# EAGLE design RF-PWR-001 (EAGLE 9.6.2)
DOCNUM: RF-PWR-001; DWBY: Lewis Russell; DWDATE: 3/2/2021; DWINIT: LR; REV: 001; TITLE: RF Power Supply Board

## Sheet 1 of 4
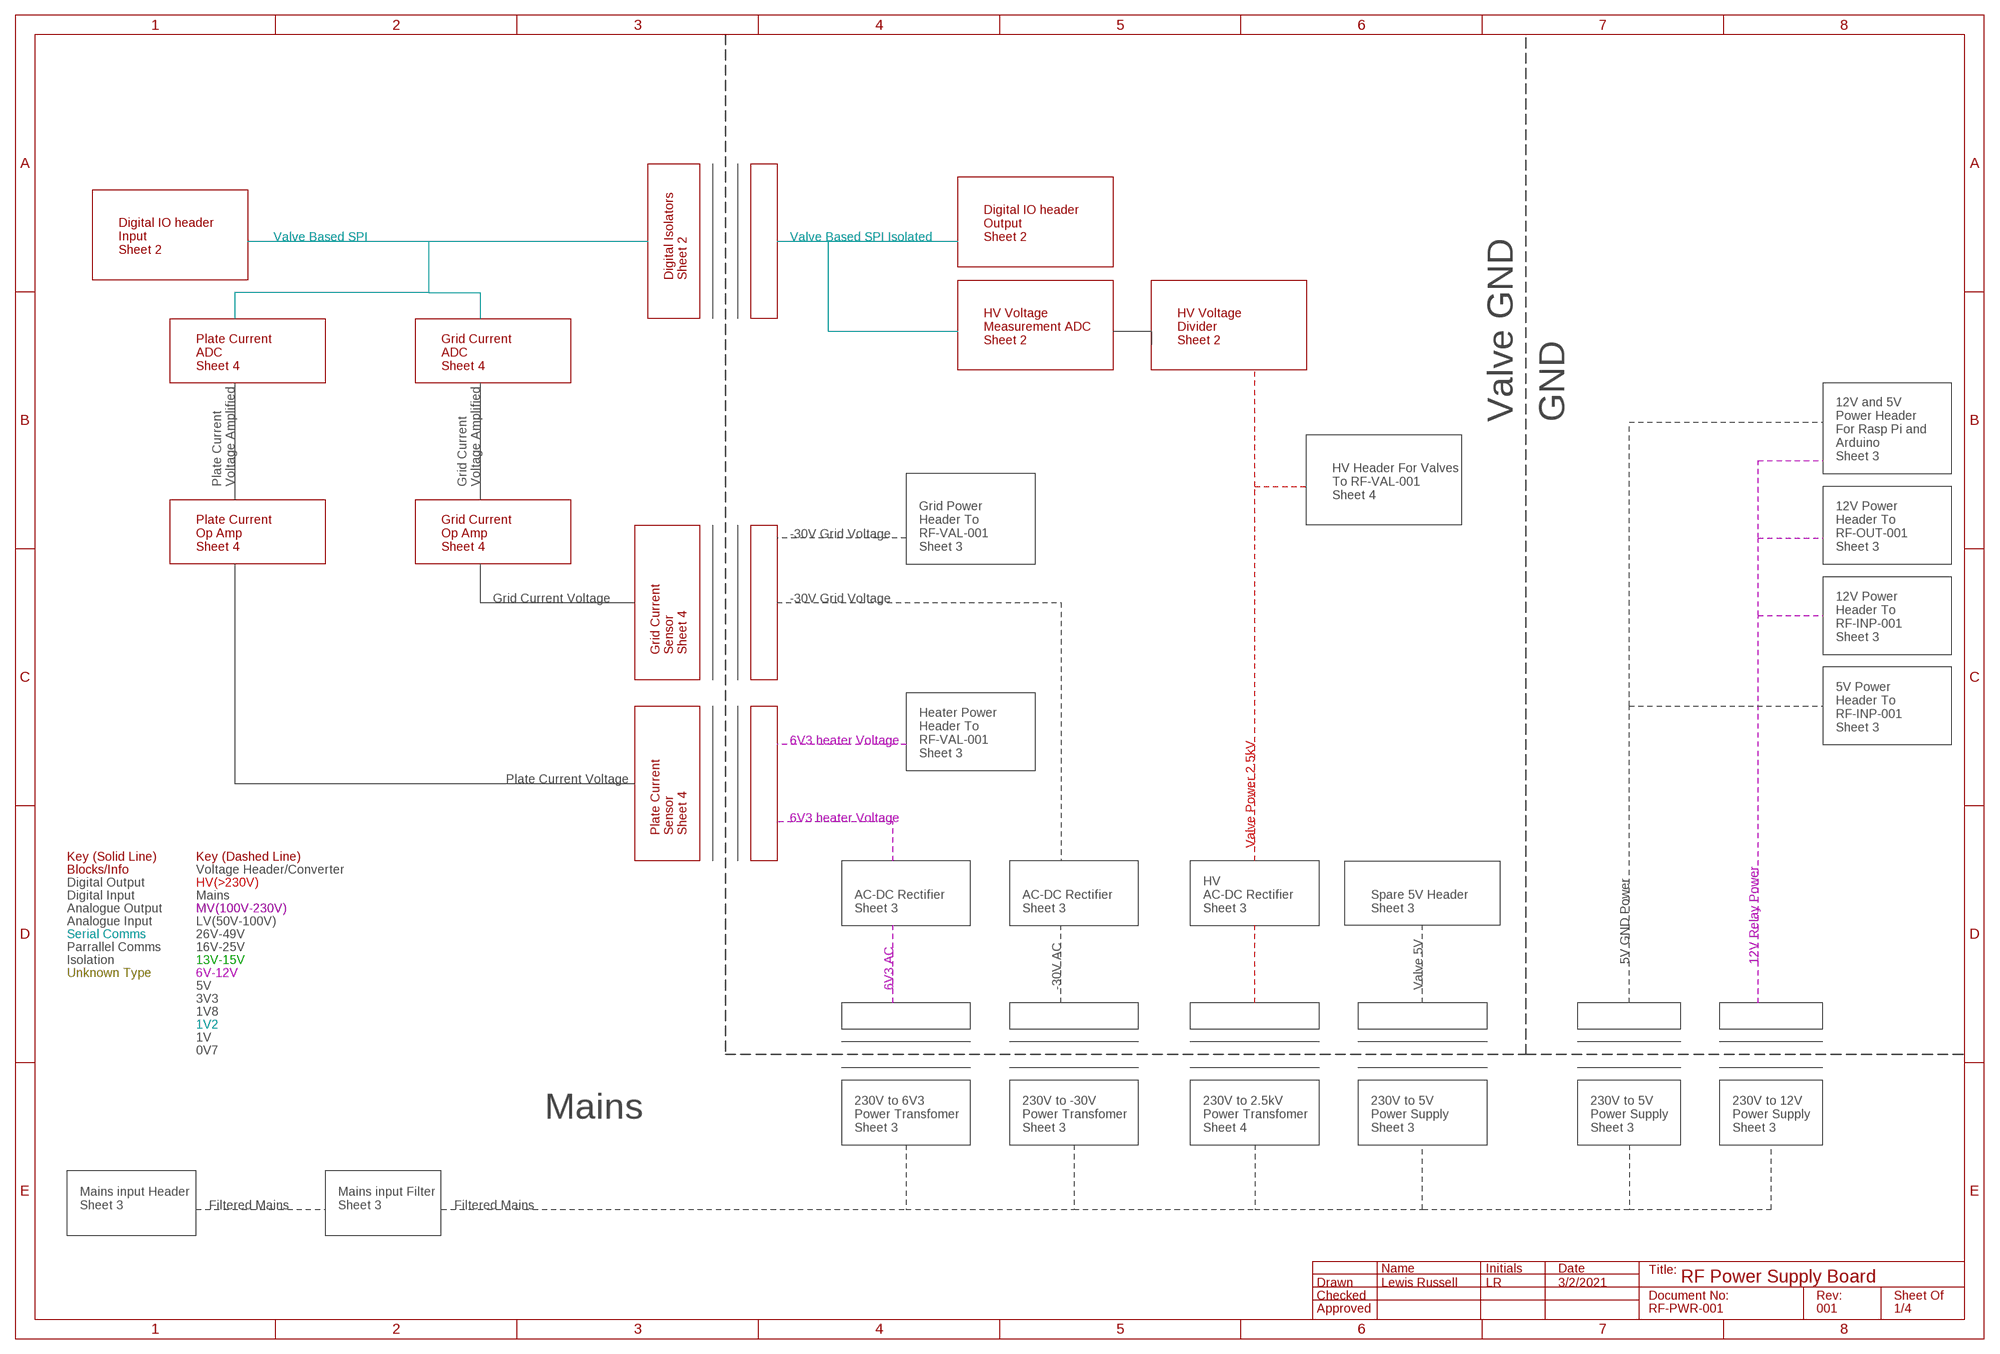
[diagram p0: schematic, sheet 1]

### Notes on the sheet
- Valve Based SPI | Valve Based SPI Isolated
- Digital IO header
  Output
  Sheet 2
- Digital IO header
  Input
  Sheet 2
- Digital Isolators
  Sheet 2
- HV Voltage
  Measurement ADC
  Sheet 2
- HV Voltage
  Divider
  Sheet 2
- Plate Current
  ADC
  Sheet 4
- Grid Current
  ADC
  Sheet 4
- Valve GND | GND
- 12V and 5V
  Power Header 
  For Rasp Pi and
  Arduino
  Sheet 3
- Plate Current
  Voltage Amplified
- Grid Current
  Voltage Amplified
- HV Header For Valves
  To RF-VAL-001
  Sheet 4
- -30V Grid Voltage
- Plate Current
  Op Amp
  Sheet 4
- Grid Current
  Op Amp
  Sheet 4
- Grid Power
  Header To
  RF-VAL-001
  Sheet 3
- 12V Power
  Header To
  RF-OUT-001
  Sheet 3
- Grid Current Voltage | -30V Grid Voltage
- 12V Power
  Header To
  RF-INP-001
  Sheet 3
- Grid Current
  Sensor
  Sheet 4
- 5V Power
  Header To
  RF-INP-001
  Sheet 3
- 6V3 heater Voltage
- Heater Power
  Header To
  RF-VAL-001
  Sheet 3
- Plate Current Voltage
- 6V3 heater Voltage
- Plate Current
  Sensor
  Sheet 4
- Valve Power 2.5kV
- Key (Solid Line) | Key (Dashed Line)
- Blocks/Info | Voltage Header/Converter
- Digital Output | HV(>230V)
- Digital Input | Mains
- Analogue Output | MV(100V-230V)
- AC-DC Rectifier
  Sheet 3
- AC-DC Rectifier
  Sheet 3
- HV
  AC-DC Rectifier
  Sheet 3
- Spare 5V Header 
  Sheet 3
- Analogue Input | LV(50V-100V)
- Serial Comms | 26V-49V
- Parrallel Comms | 16V-25V
- Isolation | 13V-15V | 5V GND Power | 12V Relay Power
- Unknown Type | 6V-12V
- 5V | 6V3 AC | -30V AC | Valve 5V
- 3V3
- 1V8
- 1V2
- 1V
- 0V7
- Mains
- 230V to 6V3
  Power Transfomer
  Sheet 3
- 230V to -30V
  Power Transfomer
  Sheet 3
- 230V to 2.5kV
  Power Transfomer
  Sheet 4
- 230V to 5V
  Power Supply
  Sheet 3
- 230V to 5V
  Power Supply
  Sheet 3
- 230V to 12V
  Power Supply
  Sheet 3
- Mains input Header
  Sheet 3
- Filtered Mains
- Mains input Filter
  Sheet 3
- Filtered Mains

## Sheet 2 of 4: Isolators
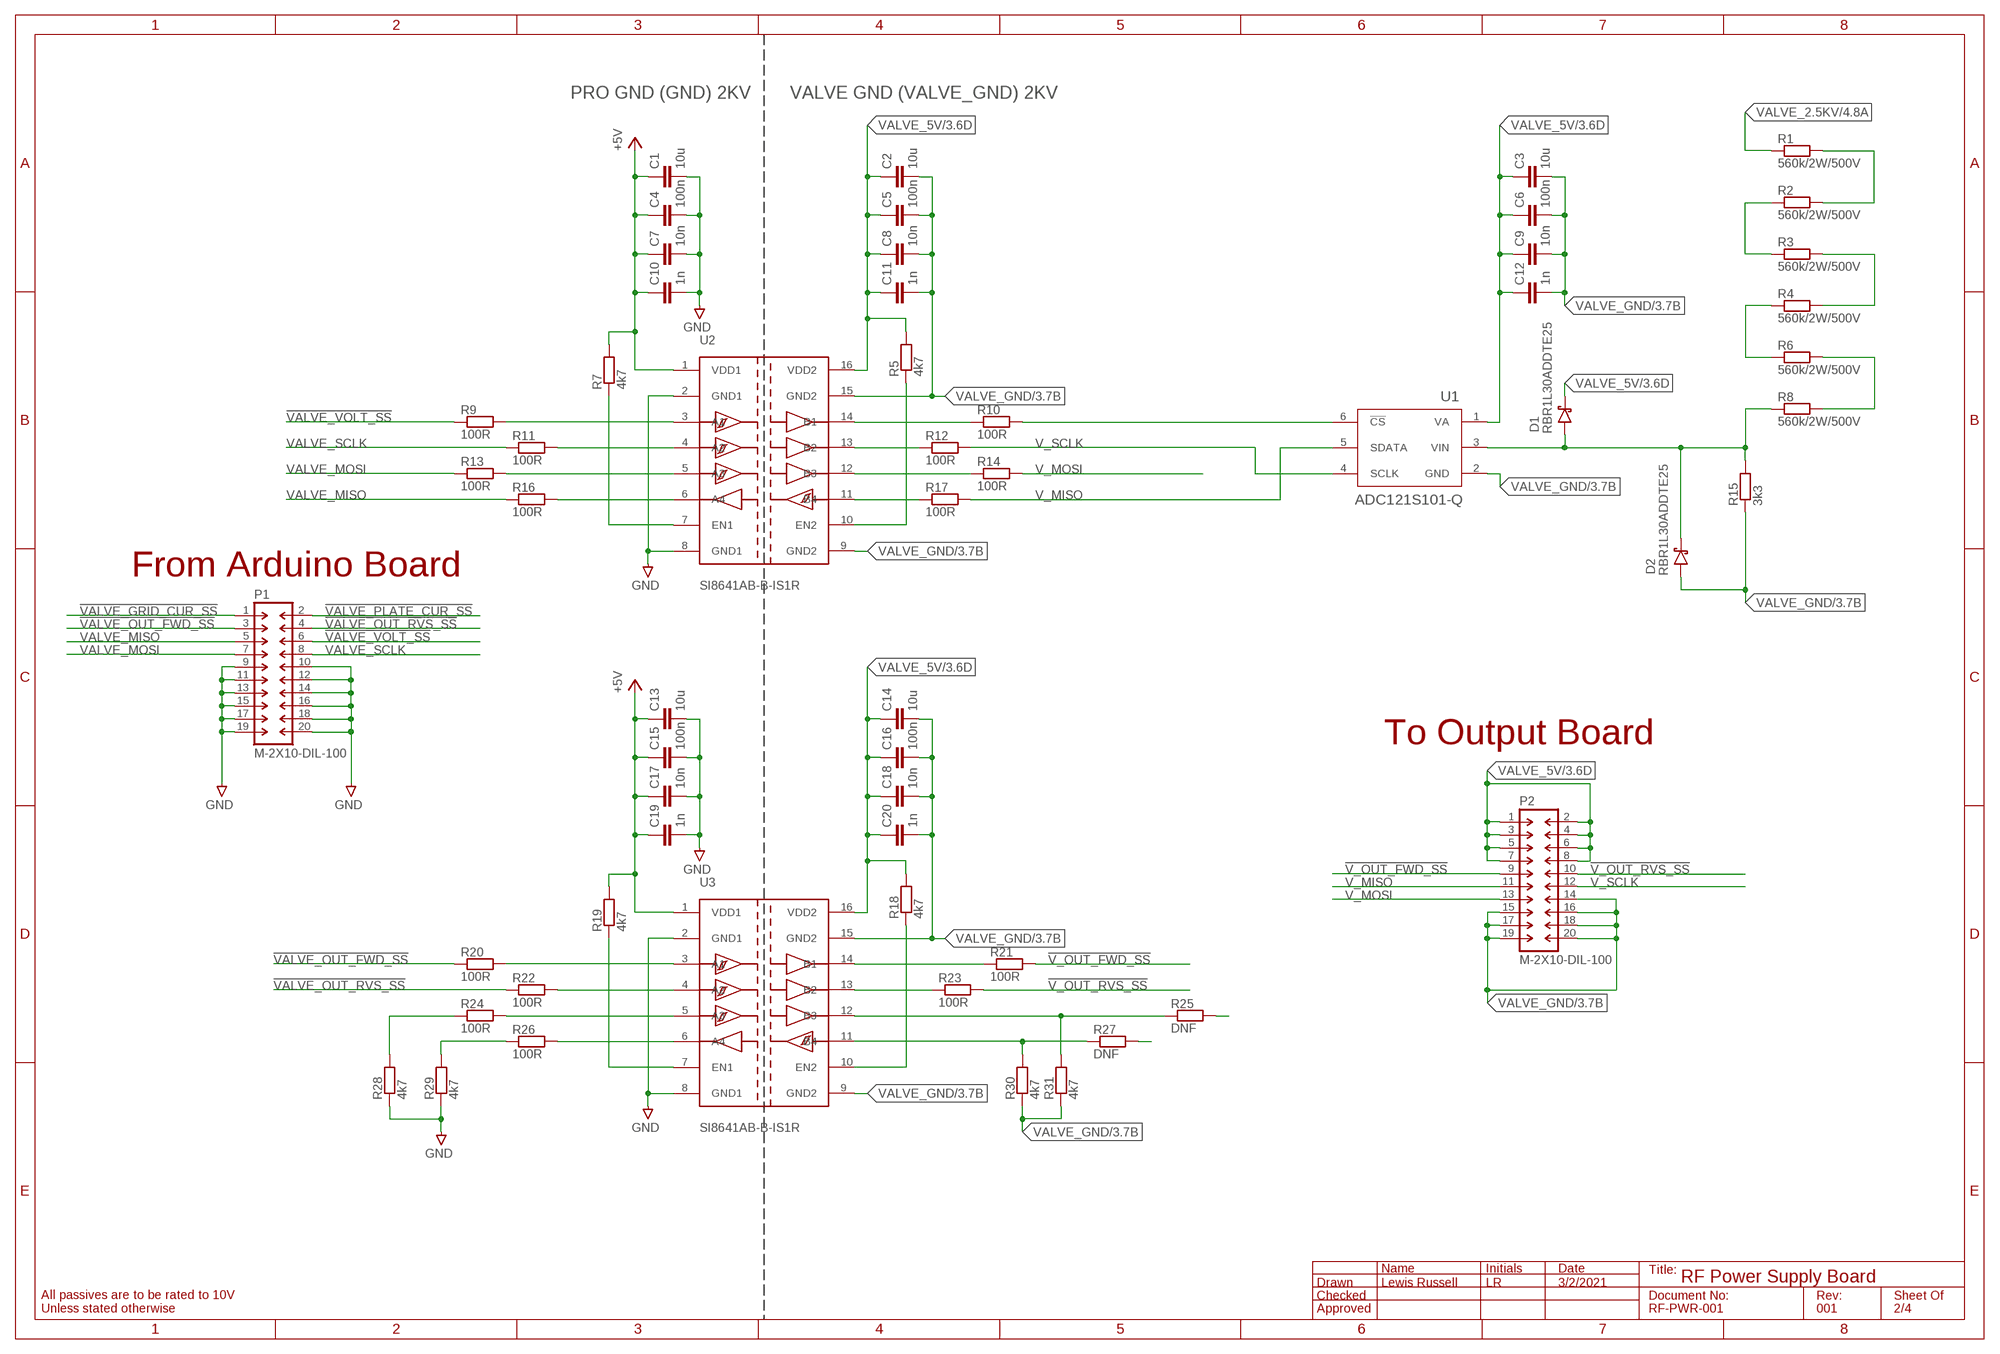
[diagram p1: schematic, sheet 2]

### Parts
C1  10u  C-EUC0805  [C0805]
C2  10u  C-EUC0805  [C0805]
C3  10u  C-EUC0805  [C0805]
C4  100n  C-EUC0603  [C0603]
C5  100n  C-EUC0603  [C0603]
C6  100n  C-EUC0603  [C0603]
C7  10n  C-EUC0603  [C0603]
C8  10n  C-EUC0603  [C0603]
C9  10n  C-EUC0603  [C0603]
C10  1n  C-EUC0603  [C0603]
C11  1n  C-EUC0603  [C0603]
C12  1n  C-EUC0603  [C0603]
C13  10u  C-EUC0805  [C0805]
C14  10u  C-EUC0805  [C0805]
C15  100n  C-EUC0603  [C0603]
C16  100n  C-EUC0603  [C0603]
C17  10n  C-EUC0603  [C0603]
C18  10n  C-EUC0603  [C0603]
C19  1n  C-EUC0603  [C0603]
C20  1n  C-EUC0603  [C0603]
D1  RBR1L30ADDTE25  SCHOTTKY_DIODESMA  [SMA/DO-214AC]
D2  RBR1L30ADDTE25  SCHOTTKY_DIODESMA  [SMA/DO-214AC]
P1  M-2X10-DIL-100  [DIL-100-2X10]
P2  M-2X10-DIL-100  [DIL-100-2X10]
R1  560k/2W/500V  R-EU_SMF2  [SMV1/SMF2]
R2  560k/2W/500V  R-EU_SMF2  [SMV1/SMF2]
R3  560k/2W/500V  R-EU_SMF2  [SMV1/SMF2]
R4  560k/2W/500V  R-EU_SMF2  [SMV1/SMF2]
R5  4k7  R-EUR0603  [R0603]
R6  560k/2W/500V  R-EU_SMF2  [SMV1/SMF2]
R7  4k7  R-EUR0603  [R0603]
R8  560k/2W/500V  R-EU_SMF2  [SMV1/SMF2]
R9  100R  R-EUR0603  [R0603]
R10  100R  R-EUR0603  [R0603]
R11  100R  R-EUR0603  [R0603]
R12  100R  R-EUR0603  [R0603]
R13  100R  R-EUR0603  [R0603]
R14  100R  R-EUR0603  [R0603]
R15  3k3  R-EUR0603  [R0603]
R16  100R  R-EUR0603  [R0603]
R17  100R  R-EUR0603  [R0603]
R18  4k7  R-EUR0603  [R0603]
R19  4k7  R-EUR0603  [R0603]
R20  100R  R-EUR0603  [R0603]
R21  100R  R-EUR0603  [R0603]
R22  100R  R-EUR0603  [R0603]
R23  100R  R-EUR0603  [R0603]
R24  100R  R-EUR0603  [R0603]
R25  DNF  R-EUR0603  [R0603]
R26  100R  R-EUR0603  [R0603]
R27  DNF  R-EUR0603  [R0603]
R28  4k7  R-EUR0603  [R0603]
R29  4k7  R-EUR0603  [R0603]
R30  4k7  R-EUR0603  [R0603]
R31  4k7  R-EUR0603  [R0603]
U1  ADC121S101-Q  [SOT23-6]
U2  SI8641AB-B-IS1R  SI8641SO16  [SO16]
U3  SI8641AB-B-IS1R  SI8641SO16  [SO16]

### Nets
!V_OUT_FWD_SS [Valve LV+Signal]: P2.9 R21.2
!V_OUT_RVS_SS [Valve LV+Signal]: P2.10 R23.2
!VALVE_GRID_CUR_SS [GND Volt+Signal]: P1.1 ; also sheet 4
!VALVE_OUT_FWD_SS [GND Volt+Signal]: P1.3 R20.1
!VALVE_OUT_RVS_SS [GND Volt+Signal]: P1.4 R22.1
!VALVE_PLATE_CUR_SS [GND Volt+Signal]: P1.2 ; also sheet 4
!VALVE_VOLT_SS [GND Volt+Signal]: P1.6 R9.1
+5V [GND Volt+Signal]: C1.1 C4.1 C7.1 C10.1 C13.1 C15.1 C17.1 C19.1 R7.2 R19.2 U2.1(VDD1) U3.1(VDD1) ; also sheet 3,4
GND [GND Volt+Signal]: C1.2 C4.2 C7.2 C10.2 C13.2 C15.2 C17.2 C19.2 P1.9 P1.10 P1.11 P1.12 P1.13 P1.14 P1.15 P1.16 P1.17 P1.18 P1.19 P1.20 R28.1 R29.1 U2.2(GND1) U2.8(GND1) U3.2(GND1) U3.8(GND1) ; also sheet 3,4
N$5 [Valve LV+Signal]: R27.2
N$7 [Valve LV+Signal]: R25.2
N$40 [GND Volt+Signal]: R24.1 R28.2
N$41 [GND Volt+Signal]: R13.2 U2.5(A3)
N$42 [GND Volt+Signal]: R16.2 U2.6(A4)
N$44 [GND Volt+Signal]: R11.2 U2.4(A2)
N$46 [GND Volt+Signal]: R9.2 U2.3(A1)
N$47 [GND Volt+Signal]: R7.1 U2.7(EN1)
N$50 [Valve LV+Signal]: R5.1 U2.10(EN2)
N$51 [Valve LV+Signal]: R14.1 U2.12(B3)
N$54 [Valve LV+Signal]: R17.1 U2.11(B4)
N$55 [Valve LV+Signal]: R27.1 R30.2 U3.11(B4)
N$57 [Valve LV+Signal]: R12.1 U2.13(B2)
N$58 [Valve LV+Signal]: R10.1 U2.14(B1)
N$60 [Valve LV+Signal]: R10.2 U1.6(!CS)
N$61 [Valve LV+Signal]: R23.1 U3.13(B2)
N$62 [Valve LV+Signal]: R21.1 U3.14(B1)
N$63 [Valve LV+Signal]: D1.A(ANODE) D2.C(CATHODE) R8.1 R15.2 U1.3(VIN)
N$68 [Valve Ladder 500V Step]: R4.1 R6.1
N$70 [Valve 500V]: R6.2 R8.2
N$75 [Valve Ladder 500V Step]: R3.2 R4.2
N$77 [Valve Ladder 500V Step]: R1.2 R2.2
N$78 [Valve Ladder 500V Step]: R2.1 R3.1
N$92 [GND Volt+Signal]: R24.2 U3.5(A3)
N$93 [GND Volt+Signal]: R26.2 U3.6(A4)
N$94 [GND Volt+Signal]: R22.2 U3.4(A2)
N$95 [GND Volt+Signal]: R20.2 U3.3(A1)
N$96 [GND Volt+Signal]: R19.1 U3.7(EN1)
N$97 [Valve LV+Signal]: R18.1 U3.10(EN2)
N$98 [Valve LV+Signal]: R25.1 R31.2 U3.12(B3)
N$106 [GND Volt+Signal]: R26.1 R29.2
V_MISO [Valve LV+Signal]: P2.11 R17.2 U1.5(SDATA)
V_MOSI [Valve LV+Signal]: P2.13 R14.2
V_SCLK [Valve LV+Signal]: P2.12 R12.2 U1.4(SCLK)
VALVE_2.5KV [Valve 2500V]: R1.1 ; also sheet 4
VALVE_5V [Valve LV+Signal]: C2.1 C3.1 C5.1 C6.1 C8.1 C9.1 C11.1 C12.1 C14.1 C16.1 C18.1 C20.1 D1.C(CATHODE) P2.1 P2.2 P2.3 P2.4 P2.5 P2.6 P2.7 P2.8 R5.2 R18.2 U1.1(VA) U2.16(VDD2) U3.16(VDD2) ; also sheet 3
VALVE_GND [Valve 48V]: C2.2 C3.2 C5.2 C6.2 C8.2 C9.2 C11.2 C12.2 C14.2 C16.2 C18.2 C20.2 D2.A(ANODE) P2.14 P2.15 P2.16 P2.17 P2.18 P2.19 P2.20 R15.1 R30.1 R31.1 U1.2(GND) U2.9(GND2) U2.15(GND2) U3.9(GND2) U3.15(GND2) ; also sheet 3,4
VALVE_MISO [GND Volt+Signal]: P1.5 R16.1 ; also sheet 4
VALVE_MOSI [GND Volt+Signal]: P1.7 R13.1
VALVE_SCLK [GND Volt+Signal]: P1.8 R11.1 ; also sheet 4

### Notes on the sheet
- PRO GND (GND) 2KV | VALVE GND (VALVE_GND) 2KV
- From Arduino Board
- To Output Board
- All passives are to be rated to 10V
  Unless stated otherwise

## Sheet 3 of 4: Mains Input and Voltage Regulation
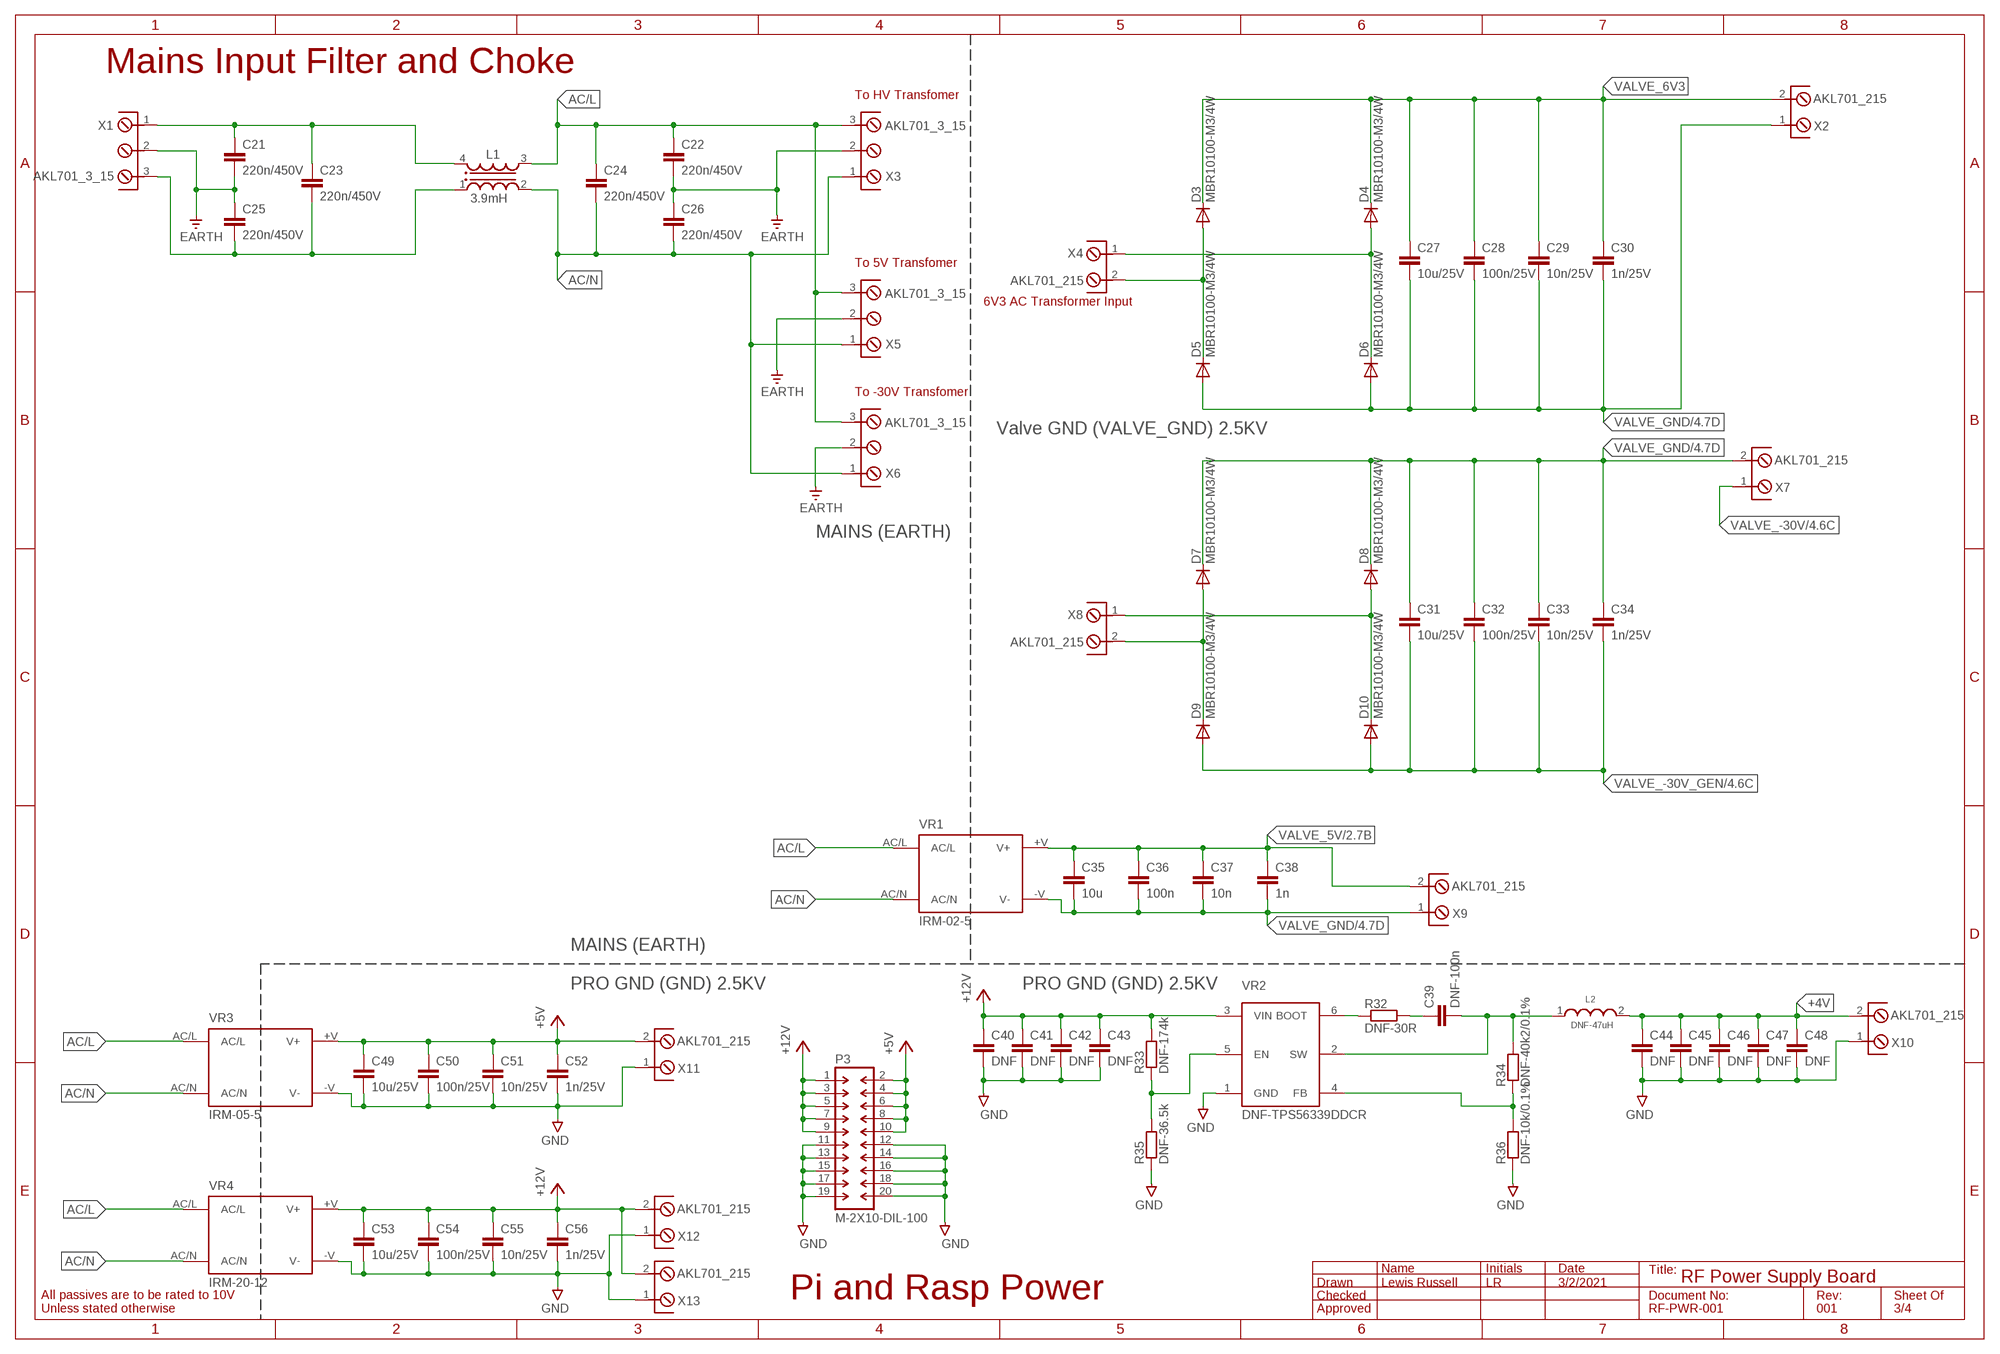
[diagram p2: schematic, sheet 3]

### Parts
C21  220n/450V  C-EUC1210  [C1210]
C22  220n/450V  C-EUC1210  [C1210]
C23  220n/450V  C-EUC1210  [C1210]
C24  220n/450V  C-EUC1210  [C1210]
C25  220n/450V  C-EUC1210  [C1210]
C26  220n/450V  C-EUC1210  [C1210]
C27  10u/25V  C-EUC0805  [C0805]
C28  100n/25V  C-EUC0603  [C0603]
C29  10n/25V  C-EUC0603  [C0603]
C30  1n/25V  C-EUC0603  [C0603]
C31  10u/25V  C-EUC0805  [C0805]
C32  100n/25V  C-EUC0603  [C0603]
C33  10n/25V  C-EUC0603  [C0603]
C34  1n/25V  C-EUC0603  [C0603]
C35  10u  C-EUC0805  [C0805]
C36  100n  C-EUC0603  [C0603]
C37  10n  C-EUC0603  [C0603]
C38  1n  C-EUC0603  [C0603]
C39  DNF-100n  C-EUC0603  [C0603]
C40  DNF  C-EUC0805  [C0805]
C41  DNF  C-EUC0603  [C0603]
C42  DNF  C-EUC0603  [C0603]
C43  DNF  C-EUC0603  [C0603]
C44  DNF  C-EUC1206  [C1206]
C45  DNF  C-EUC0805  [C0805]
C46  DNF  C-EUC0603  [C0603]
C47  DNF  C-EUC0603  [C0603]
C48  DNF  C-EUC0603  [C0603]
C49  10u/25V  C-EUC0805  [C0805]
C50  100n/25V  C-EUC0603  [C0603]
C51  10n/25V  C-EUC0603  [C0603]
C52  1n/25V  C-EUC0603  [C0603]
C53  10u/25V  C-EUC0805  [C0805]
C54  100n/25V  C-EUC0603  [C0603]
C55  10n/25V  C-EUC0603  [C0603]
C56  1n/25V  C-EUC0603  [C0603]
D3  MBR10100-M3/4W  DIODE-TO220V  [TO220ACS]
D4  MBR10100-M3/4W  DIODE-TO220V  [TO220ACS]
D5  MBR10100-M3/4W  DIODE-TO220V  [TO220ACS]
D6  MBR10100-M3/4W  DIODE-TO220V  [TO220ACS]
D7  MBR10100-M3/4W  DIODE-TO220V  [TO220ACS]
D8  MBR10100-M3/4W  DIODE-TO220V  [TO220ACS]
D9  MBR10100-M3/4W  DIODE-TO220V  [TO220ACS]
D10  MBR10100-M3/4W  DIODE-TO220V  [TO220ACS]
L1  3.9mH  WE-FCL_ET35_744866392  [WE-FCL_ET35]
L2  DNF-47uH  WE-HCF_2920_ROUND_74437529203470  [WE-HCF_2920_ROUND]
P3  M-2X10-DIL-100  [DIL-100-2X10]
R32  DNF-30R  R-EUR0603  [R0603]
R33  DNF-174k  R-EUR0603  [R0603]
R34  DNF-40k2/0.1%  R-EUR0603  [R0603]
R35  DNF-36.5k  R-EUR0603  [R0603]
R36  DNF-10k/0.1%  R-EUR0603  [R0603]
VR1  IRM-02-5  [IRM_1-2_TH]
VR2  DNF-TPS56339DDCR  TPS56339DDCR  [SOT23-6]
VR3  IRM-05-5  [IRM_5-10_TH]
VR4  IRM-20-12  [IRM_15-20_TH]
X1  AKL701_3_15  [AKL701_3_15]
X2  AKL701_215  [AKL701_2_15]
X3  AKL701_3_15  [AKL701_3_15]
X4  AKL701_215  [AKL701_2_15]
X5  AKL701_3_15  [AKL701_3_15]
X6  AKL701_3_15  [AKL701_3_15]
X7  AKL701_215  [AKL701_2_15]
X8  AKL701_215  [AKL701_2_15]
X9  AKL701_215  [AKL701_2_15]
X10  AKL701_215  [AKL701_2_15]
X11  AKL701_215  [AKL701_2_15]
X12  AKL701_215  [AKL701_2_15]
X13  AKL701_215  [AKL701_2_15]

### Nets
+4V [GND Volt+Signal]: C44.1 C45.1 C46.1 C47.1 C48.1 L2.2 X10.2
+5V [GND Volt+Signal]: C49.1 C50.1 C51.1 C52.1 P3.2 P3.4 P3.6 P3.8 P3.10 VR3.+V(V+) X11.2 ; also sheet 2,4
+12V [GND Volt+Signal]: C40.1 C41.1 C42.1 C43.1 C53.1 C54.1 C55.1 C56.1 P3.1 P3.3 P3.5 P3.7 P3.9 R33.2 VR2.3(VIN) VR4.+V(V+) X12.2 X13.2
AC/L [Mains]: C22.1 C24.1 L1.3 VR1.AC/L VR3.AC/L VR4.AC/L X3.3 X5.3 X6.3
AC/N [Mains]: C24.2 C26.2 L1.2 VR1.AC/N VR3.AC/N VR4.AC/N X3.1 X5.1 X6.1
EARTH [Mains]: C21.2 C22.2 C25.1 C26.1 X1.2 X3.2 X5.2 X6.2
GND [GND Volt+Signal]: C40.2 C41.2 C42.2 C43.2 C44.2 C45.2 C46.2 C47.2 C48.2 C49.2 C50.2 C51.2 C52.2 C53.2 C54.2 C55.2 C56.2 P3.11 P3.12 P3.13 P3.14 P3.15 P3.16 P3.17 P3.18 P3.19 P3.20 R35.1 R36.1 VR2.1(GND) VR3.-V(V-) VR4.-V(V-) X10.1 X11.1 X12.1 X13.1 ; also sheet 2,4
N$1 [Valve LV+Signal]: D3.A D5.C X4.2
N$2 [Valve LV+Signal]: D4.A D6.C X4.1
N$6 [GND Volt+Signal]: R33.1 R35.2 VR2.5(EN)
N$9 [Valve LV+Signal]: D7.A D9.C X8.2
N$10 [Valve LV+Signal]: D8.A D10.C X8.1
N$31 [Mains]: C21.1 C23.1 L1.4 X1.1
N$35 [Mains]: C23.2 C25.2 L1.1 X1.3
N$104 [GND Volt+Signal]: C39.1 R32.2
N$105 [GND Volt+Signal]: C39.2 L2.1 R34.2 VR2.2(SW)
N$148 [GND Volt+Signal]: R34.1 R36.2 VR2.4(FB)
N$300 [GND Volt+Signal]: R32.1 VR2.6(BOOT)
VALVE_5V [Valve LV+Signal]: C35.1 C36.1 C37.1 C38.1 VR1.+V(V+) X9.2 ; also sheet 2
VALVE_6V3 [Valve LV+Signal]: C27.1 C28.1 C29.1 C30.1 D3.C D4.C X2.2
VALVE_-30V [Valve 48V]: X7.1 ; also sheet 4
VALVE_-30V_GEN [Valve 48V]: C31.2 C32.2 C33.2 C34.2 D9.A D10.A ; also sheet 4
VALVE_GND [Valve 48V]: C27.2 C28.2 C29.2 C30.2 C31.1 C32.1 C33.1 C34.1 C35.2 C36.2 C37.2 C38.2 D5.A D6.A D7.C D8.C VR1.-V(V-) X2.1 X7.2 X9.1 ; also sheet 2,4

### Notes on the sheet
- Mains Input Filter and Choke
- To HV Transfomer
- To 5V Transfomer
- 6V3 AC Transformer Input
- To -30V Transfomer
- Valve GND (VALVE_GND) 2.5KV
- MAINS (EARTH)
- MAINS (EARTH)
- PRO GND (GND) 2.5KV | PRO GND (GND) 2.5KV
- Pi and Rasp Power
- All passives are to be rated to 10V
  Unless stated otherwise

## Sheet 4 of 4: HV Rectification and Current Sensing
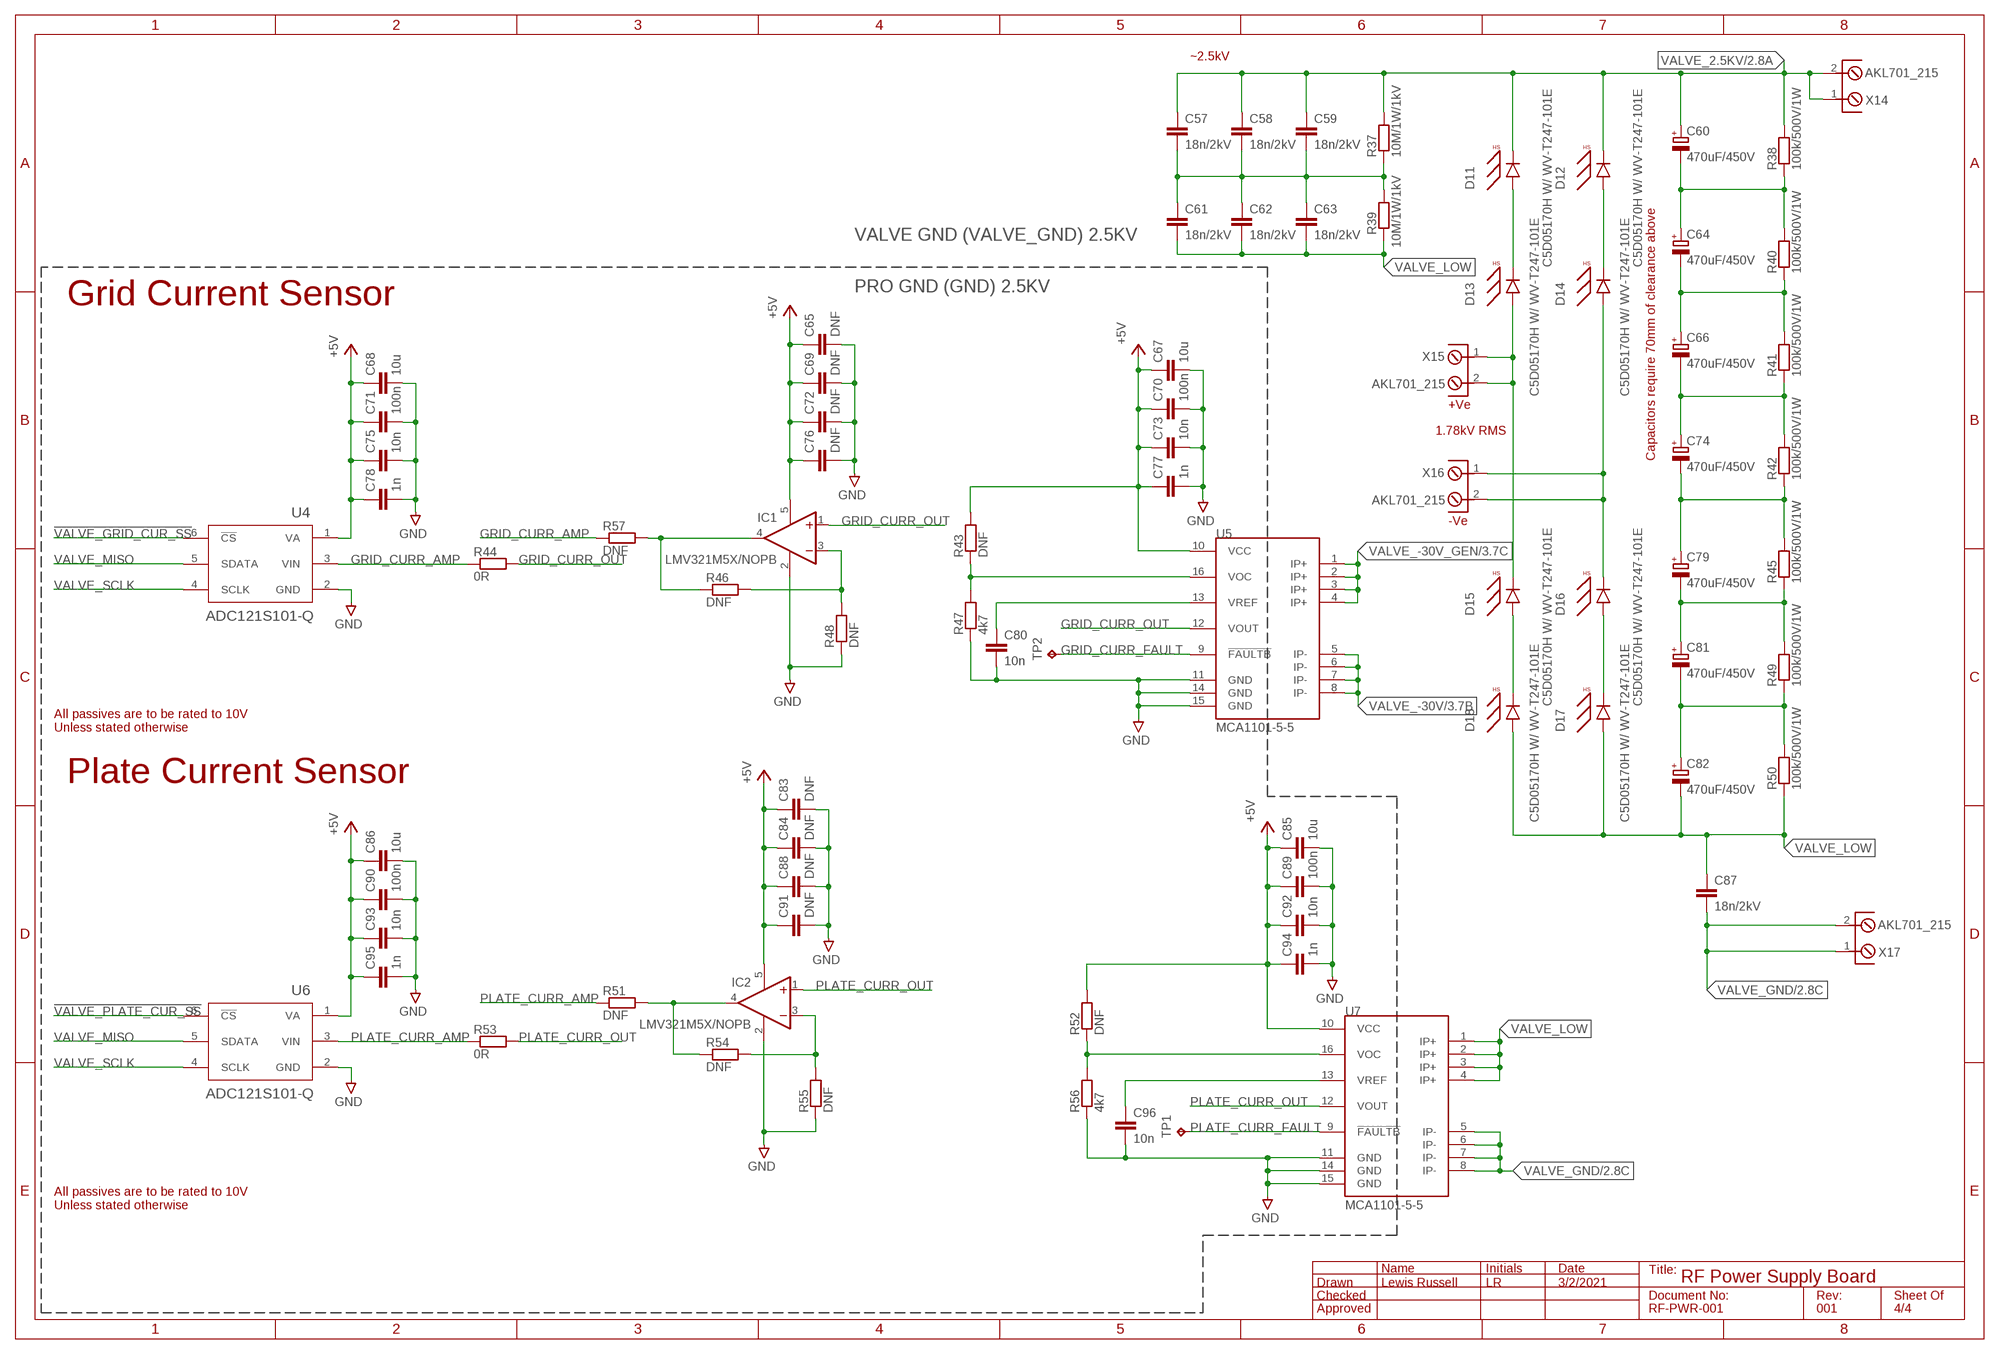
[diagram p3: schematic, sheet 4]

### Parts
C57  18n/2kV  C-EU050-075X075  [C050-075X075]
C58  18n/2kV  C-EU050-075X075  [C050-075X075]
C59  18n/2kV  C-EU050-075X075  [C050-075X075]
C60  470uF/450V  ALC10D-35MM  [STYLE_D(35MM)]
C61  18n/2kV  C-EU050-075X075  [C050-075X075]
C62  18n/2kV  C-EU050-075X075  [C050-075X075]
C63  18n/2kV  C-EU050-075X075  [C050-075X075]
C64  470uF/450V  ALC10D-35MM  [STYLE_D(35MM)]
C65  DNF  C-EUC0805  [C0805]
C66  470uF/450V  ALC10D-35MM  [STYLE_D(35MM)]
C67  10u  C-EUC0805  [C0805]
C68  10u  C-EUC0805  [C0805]
C69  DNF  C-EUC0603  [C0603]
C70  100n  C-EUC0603  [C0603]
C71  100n  C-EUC0603  [C0603]
C72  DNF  C-EUC0603  [C0603]
C73  10n  C-EUC0603  [C0603]
C74  470uF/450V  ALC10D-35MM  [STYLE_D(35MM)]
C75  10n  C-EUC0603  [C0603]
C76  DNF  C-EUC0603  [C0603]
C77  1n  C-EUC0603  [C0603]
C78  1n  C-EUC0603  [C0603]
C79  470uF/450V  ALC10D-35MM  [STYLE_D(35MM)]
C80  10n  C-EUC0603  [C0603]
C81  470uF/450V  ALC10D-35MM  [STYLE_D(35MM)]
C82  470uF/450V  ALC10D-35MM  [STYLE_D(35MM)]
C83  DNF  C-EUC0805  [C0805]
C84  DNF  C-EUC0603  [C0603]
C85  10u  C-EUC0805  [C0805]
C86  10u  C-EUC0805  [C0805]
C87  18n/2kV  C-EU050-075X075  [C050-075X075]
C88  DNF  C-EUC0603  [C0603]
C89  100n  C-EUC0603  [C0603]
C90  100n  C-EUC0603  [C0603]
C91  DNF  C-EUC0603  [C0603]
C92  10n  C-EUC0603  [C0603]
C93  10n  C-EUC0603  [C0603]
C94  1n  C-EUC0603  [C0603]
C95  1n  C-EUC0603  [C0603]
C96  10n  C-EUC0603  [C0603]
D11  C5D05170H W/ WV-T247-101E  DIODE_WITH_HEATSINKC3A1-2  [TO-247-2-WA-T247-101E]
D12  C5D05170H W/ WV-T247-101E  DIODE_WITH_HEATSINKC3A1-2  [TO-247-2-WA-T247-101E]
D13  C5D05170H W/ WV-T247-101E  DIODE_WITH_HEATSINKC3A1-2  [TO-247-2-WA-T247-101E]
D14  C5D05170H W/ WV-T247-101E  DIODE_WITH_HEATSINKC3A1-2  [TO-247-2-WA-T247-101E]
D15  C5D05170H W/ WV-T247-101E  DIODE_WITH_HEATSINKC3A1-2  [TO-247-2-WA-T247-101E]
D16  C5D05170H W/ WV-T247-101E  DIODE_WITH_HEATSINKC3A1-2  [TO-247-2-WA-T247-101E]
D17  C5D05170H W/ WV-T247-101E  DIODE_WITH_HEATSINKC3A1-2  [TO-247-2-WA-T247-101E]
D18  C5D05170H W/ WV-T247-101E  DIODE_WITH_HEATSINKC3A1-2  [TO-247-2-WA-T247-101E]
IC1  LMV321M5X/NOPB  LMV321M5  [SOT23-5]
IC2  LMV321M5X/NOPB  LMV321M5  [SOT23-5]
R37  10M/1W/1kV  R-EUR2512  [R2512]
R38  100k/500V/1W  R-EUR2512  [R2512]
R39  10M/1W/1kV  R-EUR2512  [R2512]
R40  100k/500V/1W  R-EUR2512  [R2512]
R41  100k/500V/1W  R-EUR2512  [R2512]
R42  100k/500V/1W  R-EUR2512  [R2512]
R43  DNF  R-EUR0603  [R0603]
R44  0R  R-EUR0603  [R0603]
R45  100k/500V/1W  R-EUR2512  [R2512]
R46  DNF  R-EUR0603  [R0603]
R47  4k7  R-EUR0603  [R0603]
R48  DNF  R-EUR0603  [R0603]
R49  100k/500V/1W  R-EUR2512  [R2512]
R50  100k/500V/1W  R-EUR2512  [R2512]
R51  DNF  R-EUR0603  [R0603]
R52  DNF  R-EUR0603  [R0603]
R53  0R  R-EUR0603  [R0603]
R54  DNF  R-EUR0603  [R0603]
R55  DNF  R-EUR0603  [R0603]
R56  4k7  R-EUR0603  [R0603]
R57  DNF  R-EUR0603  [R0603]
TP1  TPTP16R  [TP16R]
TP2  TPTP16R  [TP16R]
U4  ADC121S101-Q  [SOT23-6]
U5  MCA1101-5-5  [SOIC_16]
U6  ADC121S101-Q  [SOT23-6]
U7  MCA1101-5-5  [SOIC_16]
X14  AKL701_215  [AKL701_2_15]
X15  AKL701_215  [AKL701_2_15]
X16  AKL701_215  [AKL701_2_15]
X17  AKL701_215  [AKL701_2_15]

### Nets
!VALVE_GRID_CUR_SS [GND Volt+Signal]: U4.6(!CS) ; also sheet 2
!VALVE_PLATE_CUR_SS [GND Volt+Signal]: U6.6(!CS) ; also sheet 2
+5V [GND Volt+Signal]: C65.1 C67.1 C68.1 C69.1 C70.1 C71.1 C72.1 C73.1 C75.1 C76.1 C77.1 C78.1 C83.1 C84.1 C85.1 C86.1 C88.1 C89.1 C90.1 C91.1 C92.1 C93.1 C94.1 C95.1 IC1.5(V+) IC2.5(V+) R43.2 R52.2 U4.1(VA) U5.10(VCC) U6.1(VA) U7.10(VCC) ; also sheet 2,3
GND [GND Volt+Signal]: C65.2 C67.2 C68.2 C69.2 C70.2 C71.2 C72.2 C73.2 C75.2 C76.2 C77.2 C78.2 C80.2 C83.2 C84.2 C85.2 C86.2 C88.2 C89.2 C90.2 C91.2 C92.2 C93.2 C94.2 C95.2 C96.2 IC1.2(V-) IC2.2(V-) R47.1 R48.1 R55.1 R56.1 U4.2(GND) U5.11(GND) U5.14(GND) U5.15(GND) U6.2(GND) U7.11(GND) U7.14(GND) U7.15(GND) ; also sheet 2,3
GRID_CURR_AMP [GND Volt+Signal]: R44.1 R57.1 U4.3(VIN)
GRID_CURR_FAULT [GND Volt+Signal]: TP2.TP U5.9(!FAULTB)
GRID_CURR_OUT [GND Volt+Signal]: IC1.1(+IN) R44.2 U5.12(VOUT)
N$3 [GND Volt+Signal]: IC1.4(OUT) R46.1 R57.2
N$8 [GND Volt+Signal]: IC2.4(OUT) R51.2 R54.1
N$36 [Valve 500V]: C81.-VE(-) C82.+VE(+) R49.1 R50.2
N$56 [Valve 2500V]: D11.1(ANODE) D13.3(CATHODE)
N$59 [Valve 2500V]: D15.1(ANODE) D18.3(CATHODE)
N$65 [Valve 2500V]: D12.1(ANODE) D14.3(CATHODE)
N$66 [Valve 2500V]: D16.1(ANODE) D17.3(CATHODE)
N$69 [Valve Ladder 500V Step]: C79.-VE(-) C81.+VE(+) R45.1 R49.2
N$71 [Valve Ladder 500V Step]: C66.-VE(-) C74.+VE(+) R41.1 R42.2
N$72 [Valve Ladder 500V Step]: C64.-VE(-) C66.+VE(+) R40.1 R41.2
N$73 [Valve Ladder 500V Step]: C60.-VE(-) C64.+VE(+) R38.1 R40.2
N$74 [Valve Ladder 500V Step]: C74.-VE(-) C79.+VE(+) R42.1 R45.2
N$76 [GND Volt+Signal]: R52.1 R56.2 U7.16(VOC)
N$79 [GND Volt+Signal]: C96.1 U7.13(VREF)
N$99 [Valve 1250V]: C57.2 C58.2 C59.2 C61.1 C62.1 C63.1 R37.1 R39.2
N$149 [GND Volt+Signal]: R43.1 R47.2 U5.16(VOC)
N$154 [GND Volt+Signal]: IC2.3(-IN) R54.2 R55.2
N$155 [GND Volt+Signal]: C80.1 U5.13(VREF)
N$156 [GND Volt+Signal]: IC1.3(-IN) R46.2 R48.2
PLATE_CURR_AMP [GND Volt+Signal]: R51.1 R53.1 U6.3(VIN)
PLATE_CURR_FAULT [GND Volt+Signal]: TP1.TP U7.9(!FAULTB)
PLATE_CURR_OUT [GND Volt+Signal]: IC2.1(+IN) R53.2 U7.12(VOUT)
VALVE_2.5KV [Valve 2500V]: C57.1 C58.1 C59.1 C60.+VE(+) D11.3(CATHODE) D12.3(CATHODE) R37.2 R38.2 X14.1 X14.2 ; also sheet 2
VALVE_-30V [Valve 48V]: U5.5(IP-) U5.6(IP-) U5.7(IP-) U5.8(IP-) ; also sheet 3
VALVE_-30V_GEN [Valve 48V]: U5.1(IP+) U5.2(IP+) U5.3(IP+) U5.4(IP+) ; also sheet 3
VALVE_GND [Valve 48V]: C87.2 U7.5(IP-) U7.6(IP-) U7.7(IP-) U7.8(IP-) X17.1 X17.2 ; also sheet 2,3
VALVE_LOW [Valve LV+Signal]: C61.2 C62.2 C63.2 C82.-VE(-) C87.1 D17.1(ANODE) D18.1(ANODE) R39.1 R50.1 U7.1(IP+) U7.2(IP+) U7.3(IP+) U7.4(IP+)
VALVE_MISO [GND Volt+Signal]: U4.5(SDATA) U6.5(SDATA) ; also sheet 2
VALVE_PWR_+VE [Valve 2500V]: D13.1(ANODE) D15.3(CATHODE) X15.1 X15.2
VALVE_PWR_-VE [Valve 2500V]: D14.1(ANODE) D16.3(CATHODE) X16.1 X16.2
VALVE_SCLK [GND Volt+Signal]: U4.4(SCLK) U6.4(SCLK) ; also sheet 2

### Notes on the sheet
- ~2.5kV
- VALVE GND (VALVE_GND) 2.5KV
- PRO GND (GND) 2.5KV
- Grid Current Sensor
- +Ve
- 1.78kV RMS
- Capacitors require 70mm of clearance above
- -Ve
- All passives are to be rated to 10V
  Unless stated otherwise
- Plate Current Sensor
- All passives are to be rated to 10V
  Unless stated otherwise

## Library data of the parts
C1-C59 C61-C63 C65 C67-C73 C75-C78 C80 C83-C96 = Mage-Control:C-EU: CAPACITOR, European symbol
C60 C64 C66 C74 C79 C81 C82 = ALC10:ALC10D: ALC10 Aluminum Electrolytic Capacitors Using Termination Style D Up to 600VDC ratings High Ripple Current 47uF-100mF Operational Lifespan in hours D (mm), Rated Voltage and Ripple @ 85C/Rated Voltage @ 85C 25, 10000/16000 30, 13000/21000 35, 15000/24000 40, 18000/29000 45, 18000/29000 50, 18000/29000 Made By: Lewis Russell 13/8/2020 Checked By: Jamie SLavin 19/08/2020
D1 D2 = DO-214 Diodes:SCHOTTKY_DIODE: DO-214 package regular diode Varients SMA = DO-214AC SMB = DO-214AA SMC = DO-214AB Made By: Lewis Russell 29/6/2020 Checked By: Fraser Douglas 29/6/2020
D3-D10 = _mod_diode:DIODE-: DIODE
D11-D18 = TO-247 Diode:DIODE_WITH_HEATSINK: TO-247 package regular diode TO-247-2 Package Varients C1A3-2 = Cathode on Pin 1, Annode on Pin 3 C3A1-2 = Cathode on Pin 3, Annode on Pin 1 TO-247-3 Package Varients C12A3-3 = Cathode on Pin 1 and 2, Annode on Pin 3 C13A2-3 = Cathode on Pin 1 and 3, Annode on Pin 2 C23A1-3 = Cathode on Pin 2 and 3, Annode on Pin 1 C1A23-3 = Cathode on Pin 1, Annode on Pin 2 and 3 C2A13-3 = Cathode on Pin 2, Annode on Pin 1 and 3 C3A12-3 = Cathode on Pin 3, Annode on Pin 1 and 2 WARNING in some Diodes the rear tab is electrically connected thus Heatsink might be live IMPORTANT When using this part please set the part number in the schematic to be "-MOSFET PN- With -HEATSINK PN-" . Once the BOM has been generated manually add the Heatsink to the BOM and correct part numbers for the MOSFET _TO-247-WA-T247-101E Varient is for use with the Ohmite WA-T247-101E Heatsink, Mouser No: 588-WA-T247-101E Made By: Lewis Russell 22/3/2021 Checked By:
IC1 IC2 = linear:LMV321?*: General Purpose, Low Voltage, Rail-to-Rail Output Operational Amplifiers Source: http://www.national.com/mpf/LM/LMV321.html http://www.national.com/dt/lmv_qual.pdf
L1 = Wurth_EMC Components_WE-FCL:WE-FCL_ET35: WE-FCL Common Mode Power Line Choke Characteristics Approximate 1% stray inductance for symmetrical interference suppression Closed rectangular ferrite core Attenuation up to 75 dB with high rated current. Inductance Tolerance: +50 %/-30% Flammability corresponding to UL 94 V-0 Climatic category 40/125/21 Application Mains filter Suppression of common mode noise Switched mode power supplies Electronic ballast applications Lighting White goods <https://katalog.we-online.com/media/images/v2/o14784v209%20Family_WE-FCL_ET35.jpg> Details see: https://katalog.we-online.com/en/pbs/WE-FCL Updated by Ella Wu 2019-05-31 2019 (C) Wurth Elektronik; DATASHEET-URL: https://katalog.we-online.com/pbs/datasheet/744866392.pdf; IR: 5A; MOUNT: THT; PART-NUMBER: 744866392; RDC: 50mOhm; VR: 250 V (AC); VT: 1500 V (AC)
L2 = Wurth_Power Magnetics_WE-HCF:WE-HCF_2920_ROUND: WE-HCF SMD High Current Inductor Characteristics Saturation current up to 125 A Flat, round and litz wire version to optimize the DC & AC losses Inductance values ranging from 0.7 µH to 680 µH Low core losses (MnZn) Magnetically shielded Litz and round wire: base for SMD mount and coplanarity Operating temperature: -40°C to +125°C Applications Storage inductor for high efficiency DC/DC converters with high ripple currents CRM, CCM & DCM PFC Stages Resonant SMPS Filter for audio applications <https://www.we-online.com/catalog/media/o107965v209%20Family_WE-HCF_2018_2.jpg> Details see: https://www.we-online.com/catalog/en/WE-HCF Updated by Yingchun Shan 2019-08-07 2019 (C) Wurth Elektronik; DATASHEET-URL: https://www.we-online.com/catalog/datasheet/74437529203470.pdf; FRES: 6.7MHz; IR: 18.7A; ISAT: 13A; PART-NUMBER: 74437529203470; RDC: 8.8mOhm; VALUE: 47uH
P1-P3 = con-headers-jp:M-2X10-: MALE HEADER
R1-R4 R6 R8 = TE Connectivity SM_ Resistors:R-EU: TE Connectivity SM_ Series Resistors SMV = Thick Film Resistors 1-3W SMF = Thin Film Resistors 2,3,5W SMW = Wirewound Resistors 2,3,5W Tollerances SMV = 5% SMF/SMW = 1% or 5% Temperture Range = -55 to 200C E24 Working Voltages SMV1 = 1600 VDC, 1150 VRMS SMV2 = 3500 VDC, 2500 VRMS SMV3 = 5000 VDC, 3500 VRMS SMW/F2 = 300V SMW/F3 = 500V SMW/F5 = 500V Made By: Lewis Russell 13/8/2020 Checked By: Jamie Slavin Date: 17/08/2020
R5 R7 R9-R57 = Mage-Control:R-EU: RESISTOR, European symbol
TP1 TP2 = testpad:TP: Test pad
U1 U4 U6 = ADC121S101:ADC121S101-Q: Single-Channel, 0.5 to 1-Msps, 12-Bit Analog-to-Digital Converter 2.7-5.5V supply range, -40C to +125C temperature range. Automotive qualified. Made by: Francis Pettitt Date: 11/05/20 Checked by: Jamie Slavin Date: 11/05/20
U2 U3 = SI8641:SI8641: SI8641 4 channel digital islator High Speed Operation up to 150Mbps Operating votlage = 2.5-5.5V -40C to 125C 3 Forward/1Backwards Automotive qualitifcation https://www.mouser.co.uk/datasheet/2/368/si864x-datasheet-1154572.pdf Created by: Francis Pettitt 15/01/20 Reviewed by: Lewis Russell 24/8/2020
U5 U7 = MCA1101-CC-V:MCA1101: MCA1101-CC-V Bidierectional Isolating Current sensor IC CC = Current Rating = 05, 20 and 50 V = Voltage Rating = 3V3 or 5V Availiable in 5, 20 and 50A Variants 0.6% Error @ 25C 2% max error over temperture range Operating Temp = -40 to 105C Isolation Dielectic strength Voltage = 4800V Basic Isolation Voltage = 1097 VRMS Reinforced Isolation Voltage = 400 VRMS Package = SOIC-16 Frequency Response = 1.5MHz (typical 3dB BW) Made by: Lewis Russell 9/4/2020 Checked by:
VR1 = IRM AC to DC:IRM-02: IRM 2W AC to DC Converter Several output voltages from 3.3V to 24V no load power consumption = 0.075W Isolation Resistance = 100MOhm 500VDC Up to 77% efficency Made By: Lewis Russell 5/8/2020 Checked by: Fraser Douglas 5/8/2020
VR2 = TPS56339:TPS56339DDCR: TPS56339 Synchronous Buck Converter Input Voltage= 4.5V to 24V Output Voltage = 0.8V to 16V 3A Maximum Continuous Output Current 500 KHz Switching Frequency Package SOT-23-6 Made By: Lewis Russell 5/8/2020 Checked By: Fraser Douglas 6/8/2020
VR3 = IRM AC to DC:IRM-05: IRM 5W AC to DC Converter Several output voltages from 3.3V to 24V no load power consumption = 0.1W Isolation Resistance = 100MOhm 500VDC Up to 77% efficency Made By: Lewis Russell 5/8/2020 Checked by: Fraser Douglas 5/8/2020
VR4 = IRM AC to DC:IRM-20: IRM 20W AC to DC Converter Several output voltages from 3.3V to 24V no load power consumption = 0.1W Isolation Resistance = 100MOhm 500VDC Up to 85% efficency Made By: Lewis Russell 5/8/2020 Checked by: Fraser Douglas 5/8/2020
X1 X3 X5 X6 = _con_riacon_akl701:AKL701_3*: RIACON (Ria Connect) Screw Type Terminal Block Type AKL 701 - 3 (pole-size: 3) centerline 6.35 mm / 0.250 inches, 400 V / 24 A, horizontal wire entry, lift system, modular packages: _13: recommended pcb hole dia. = 1,3 mm _15: pcb hole dia. = 1,5 mm (prototyping) Auhtor: Dipl.-Ing. FH Rainer Bayer, Hochschule Heilbronn (rainer.bayer@hs-heilbronn.de)
X2 X4 X7-X17 = _con_riacon_akl701:AKL701_2*: RIACON (Ria Connect) Screw Type Terminal Block Type AKL 701 - 2 (pole-size: 2) centerline 6.35 mm / 0.250 inches, 400 V / 24 A, horizontal wire entry, lift system, modular packages: _13: recommended pcb hole dia. = 1,3 mm _15: pcb hole dia. = 1,5 mm (prototyping) Auhtor: Dipl.-Ing. FH Rainer Bayer, Hochschule Heilbronn (rainer.bayer@hs-heilbronn.de)

## Net classes
1 Mains: width 0.7 mm, drill 0.4 mm, clearance 1 mm to class 0, clearance 0.8 mm
2 GND Volt+Signal: width 0.2 mm, drill 0.4 mm, clearance 10 mm to class 0, clearance 6.9 mm to class 1, clearance 0.13 mm
3 Valve LV+Signal: width 0.2 mm, drill 0.4 mm, clearance 10 mm to class 0, clearance 6.9 mm to class 1, clearance 3.2 mm to class 2, clearance 0.13 mm
4 Valve 48V: width 0.2 mm, drill 0.4 mm, clearance 10 mm to class 0, clearance 6.9 mm to class 1, clearance 3.2 mm to class 2, clearance 0.13 mm to class 3, clearance 0.13 mm
5 Valve 500V: width 0.2 mm, drill 0.4 mm, clearance 10 mm to class 0, clearance 14.525 mm to class 1, clearance 14.525 mm to class 2, clearance 0.8 mm to class 3, clearance 0.8 mm to class 4, clearance 0.8 mm
6 HV_SIG: width 0.2 mm, drill 0.4 mm, clearance 10 mm to class 0, clearance 3.2 mm to class 1, clearance 3.2 mm to class 2, clearance 14.525 mm to class 3, clearance 0.13 mm to class 4, clearance 3.2 mm to class 5, clearance 0.13 mm
8 Valve 1250V: width 0.2 mm, drill 0.4 mm, clearance 10 mm to class 0, clearance 14.525 mm to class 1, clearance 14.525 mm to class 2, clearance 3.087 mm to class 3, clearance 3.087 mm to class 4, clearance 1.562 mm to class 5, clearance 0.8 mm to class 6, clearance 0.8 mm to class 7, clearance 3.087 mm
9 Valve 2500V: width 0.2 mm, drill 0.4 mm, clearance 10 mm to class 0, clearance 14.525 mm to class 1, clearance 14.525 mm to class 2, clearance 6.9 mm to class 3, clearance 6.9 mm to class 4, clearance 6.9 mm to class 5, clearance 6.9 mm to class 6, clearance 6.9 mm to class 7, clearance 3.087 mm to class 8, clearance 6.9 mm
10 Valve Ladder 500V Step: width 0.2 mm, drill 0.4 mm, clearance 10 mm to class 0, clearance 14.525 mm to class 1, clearance 14.525 mm to class 2, clearance 6.9 mm to class 3, clearance 6.9 mm to class 4, clearance 0.8 mm to class 5, clearance 6.9 mm to class 6, clearance 6.9 mm to class 7, clearance 6.9 mm to class 8, clearance 0.8 mm to class 9, clearance 0.8 mm

## Board
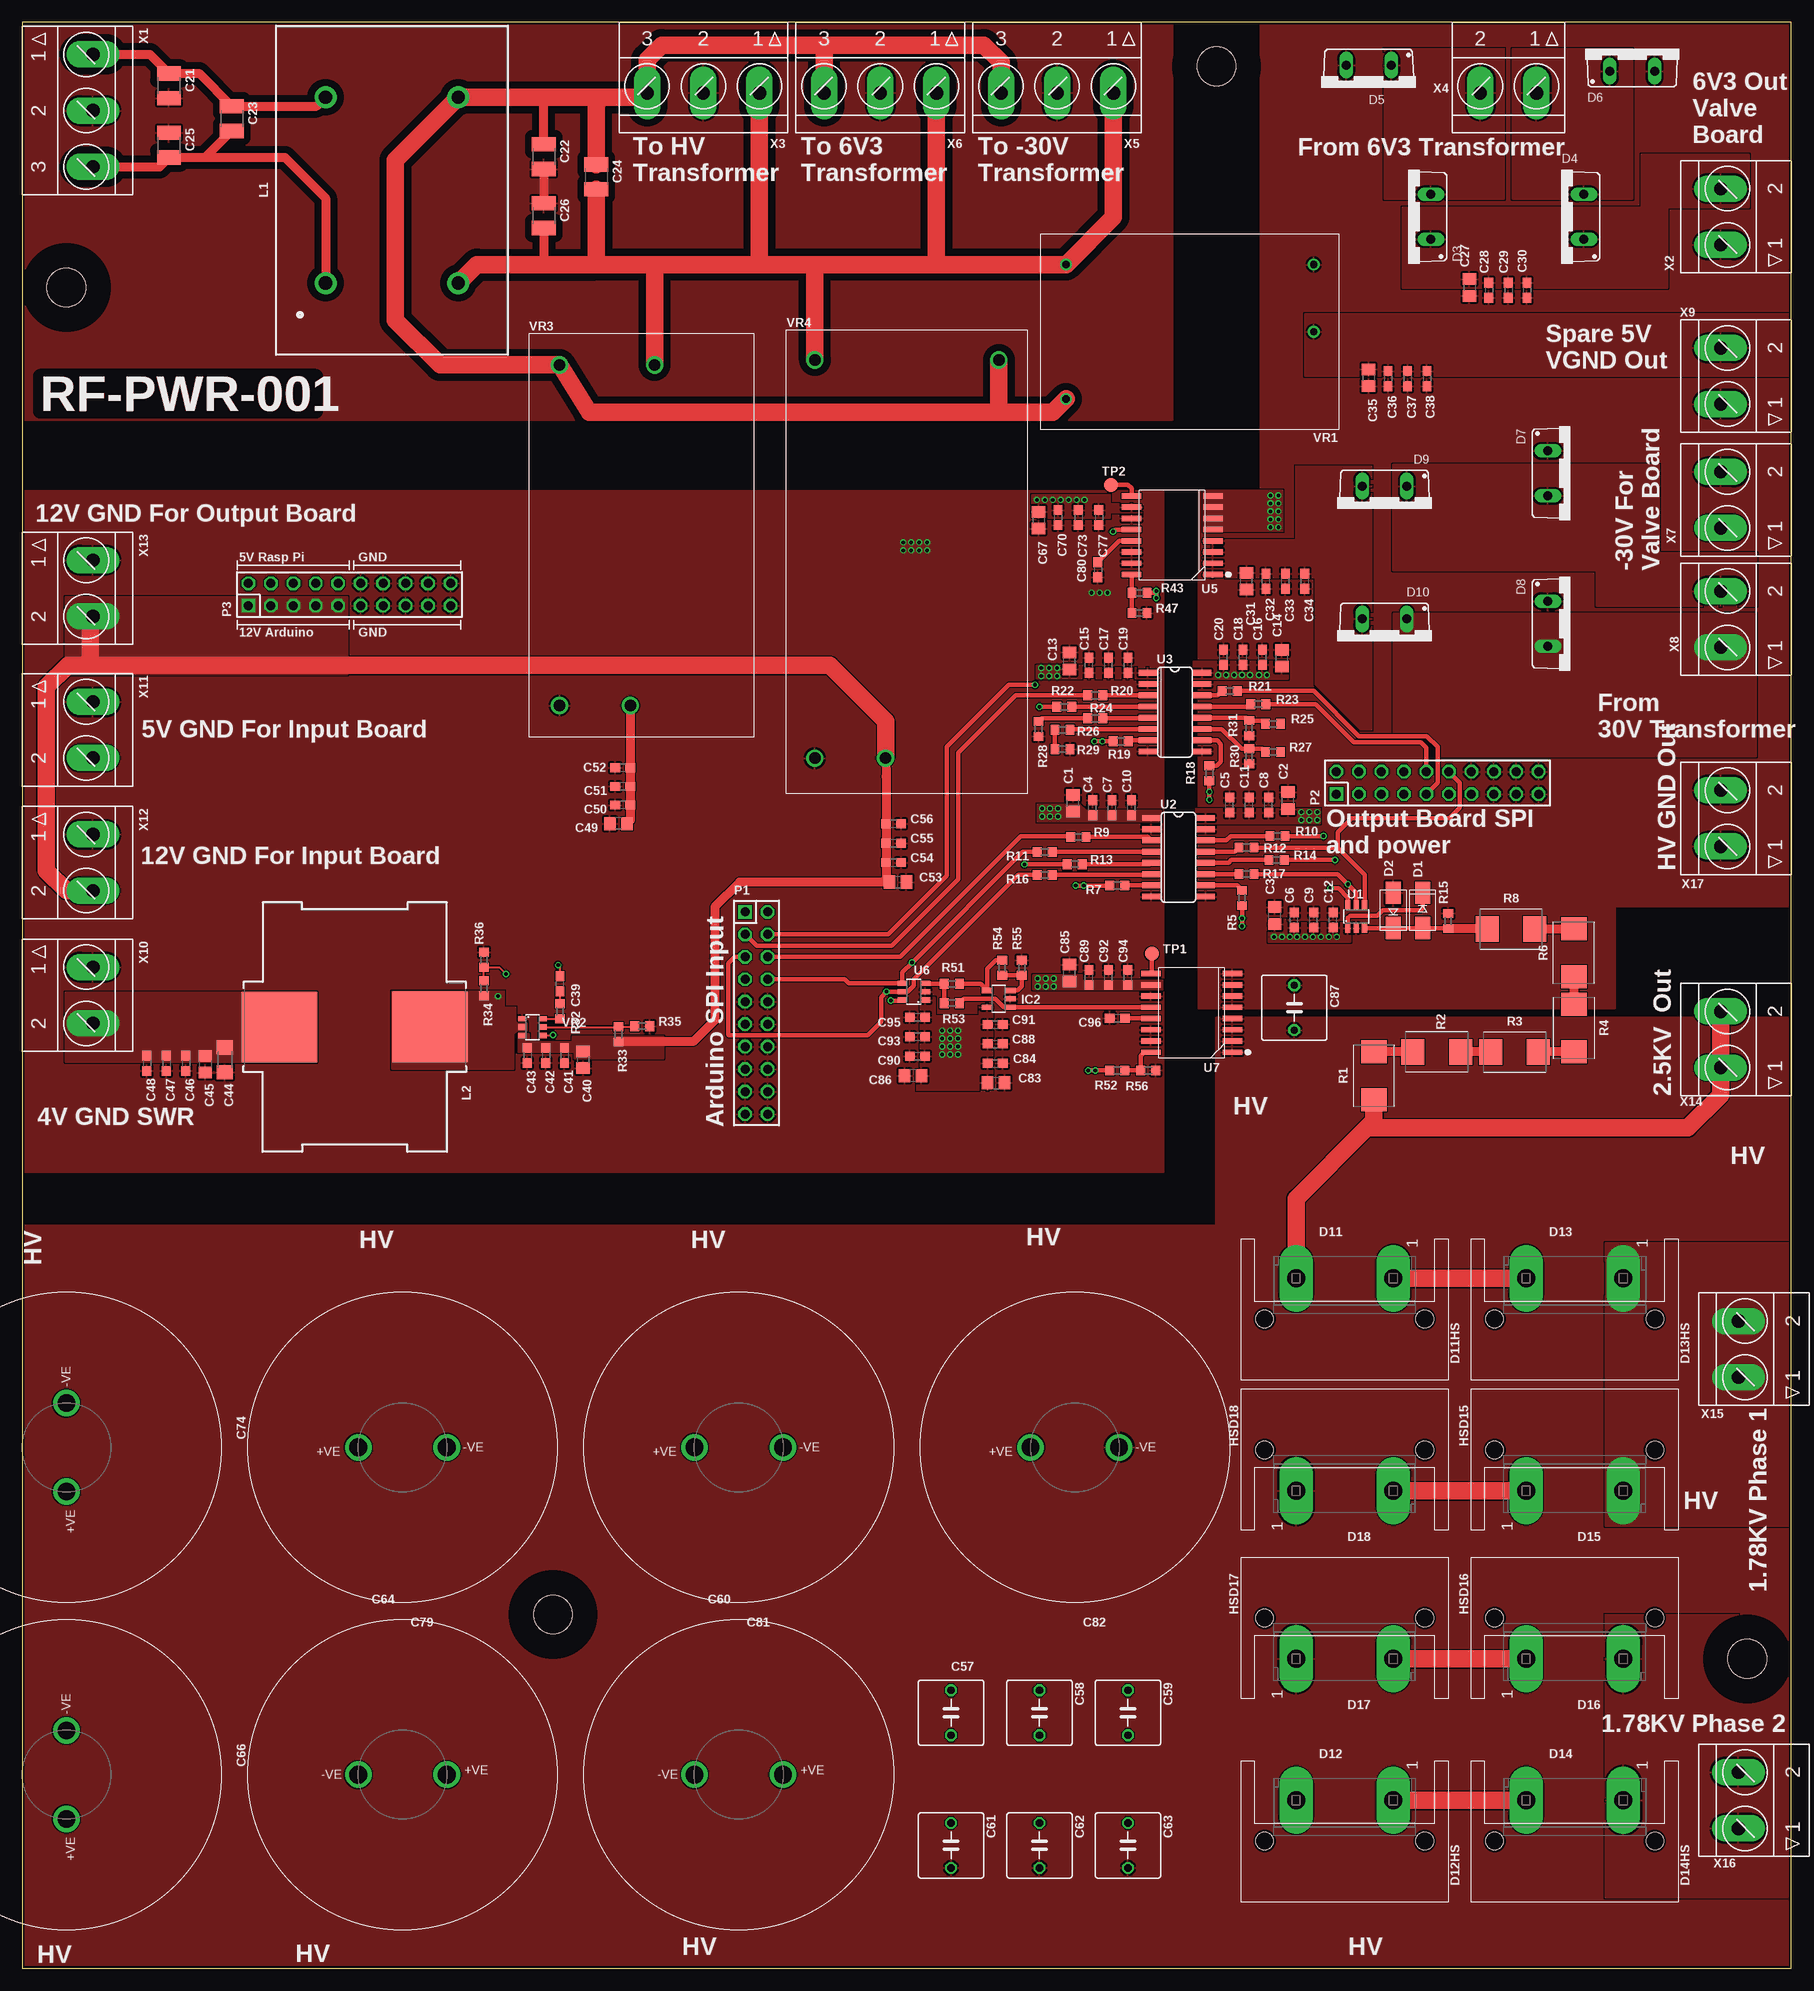
[diagram p4: board, top side]
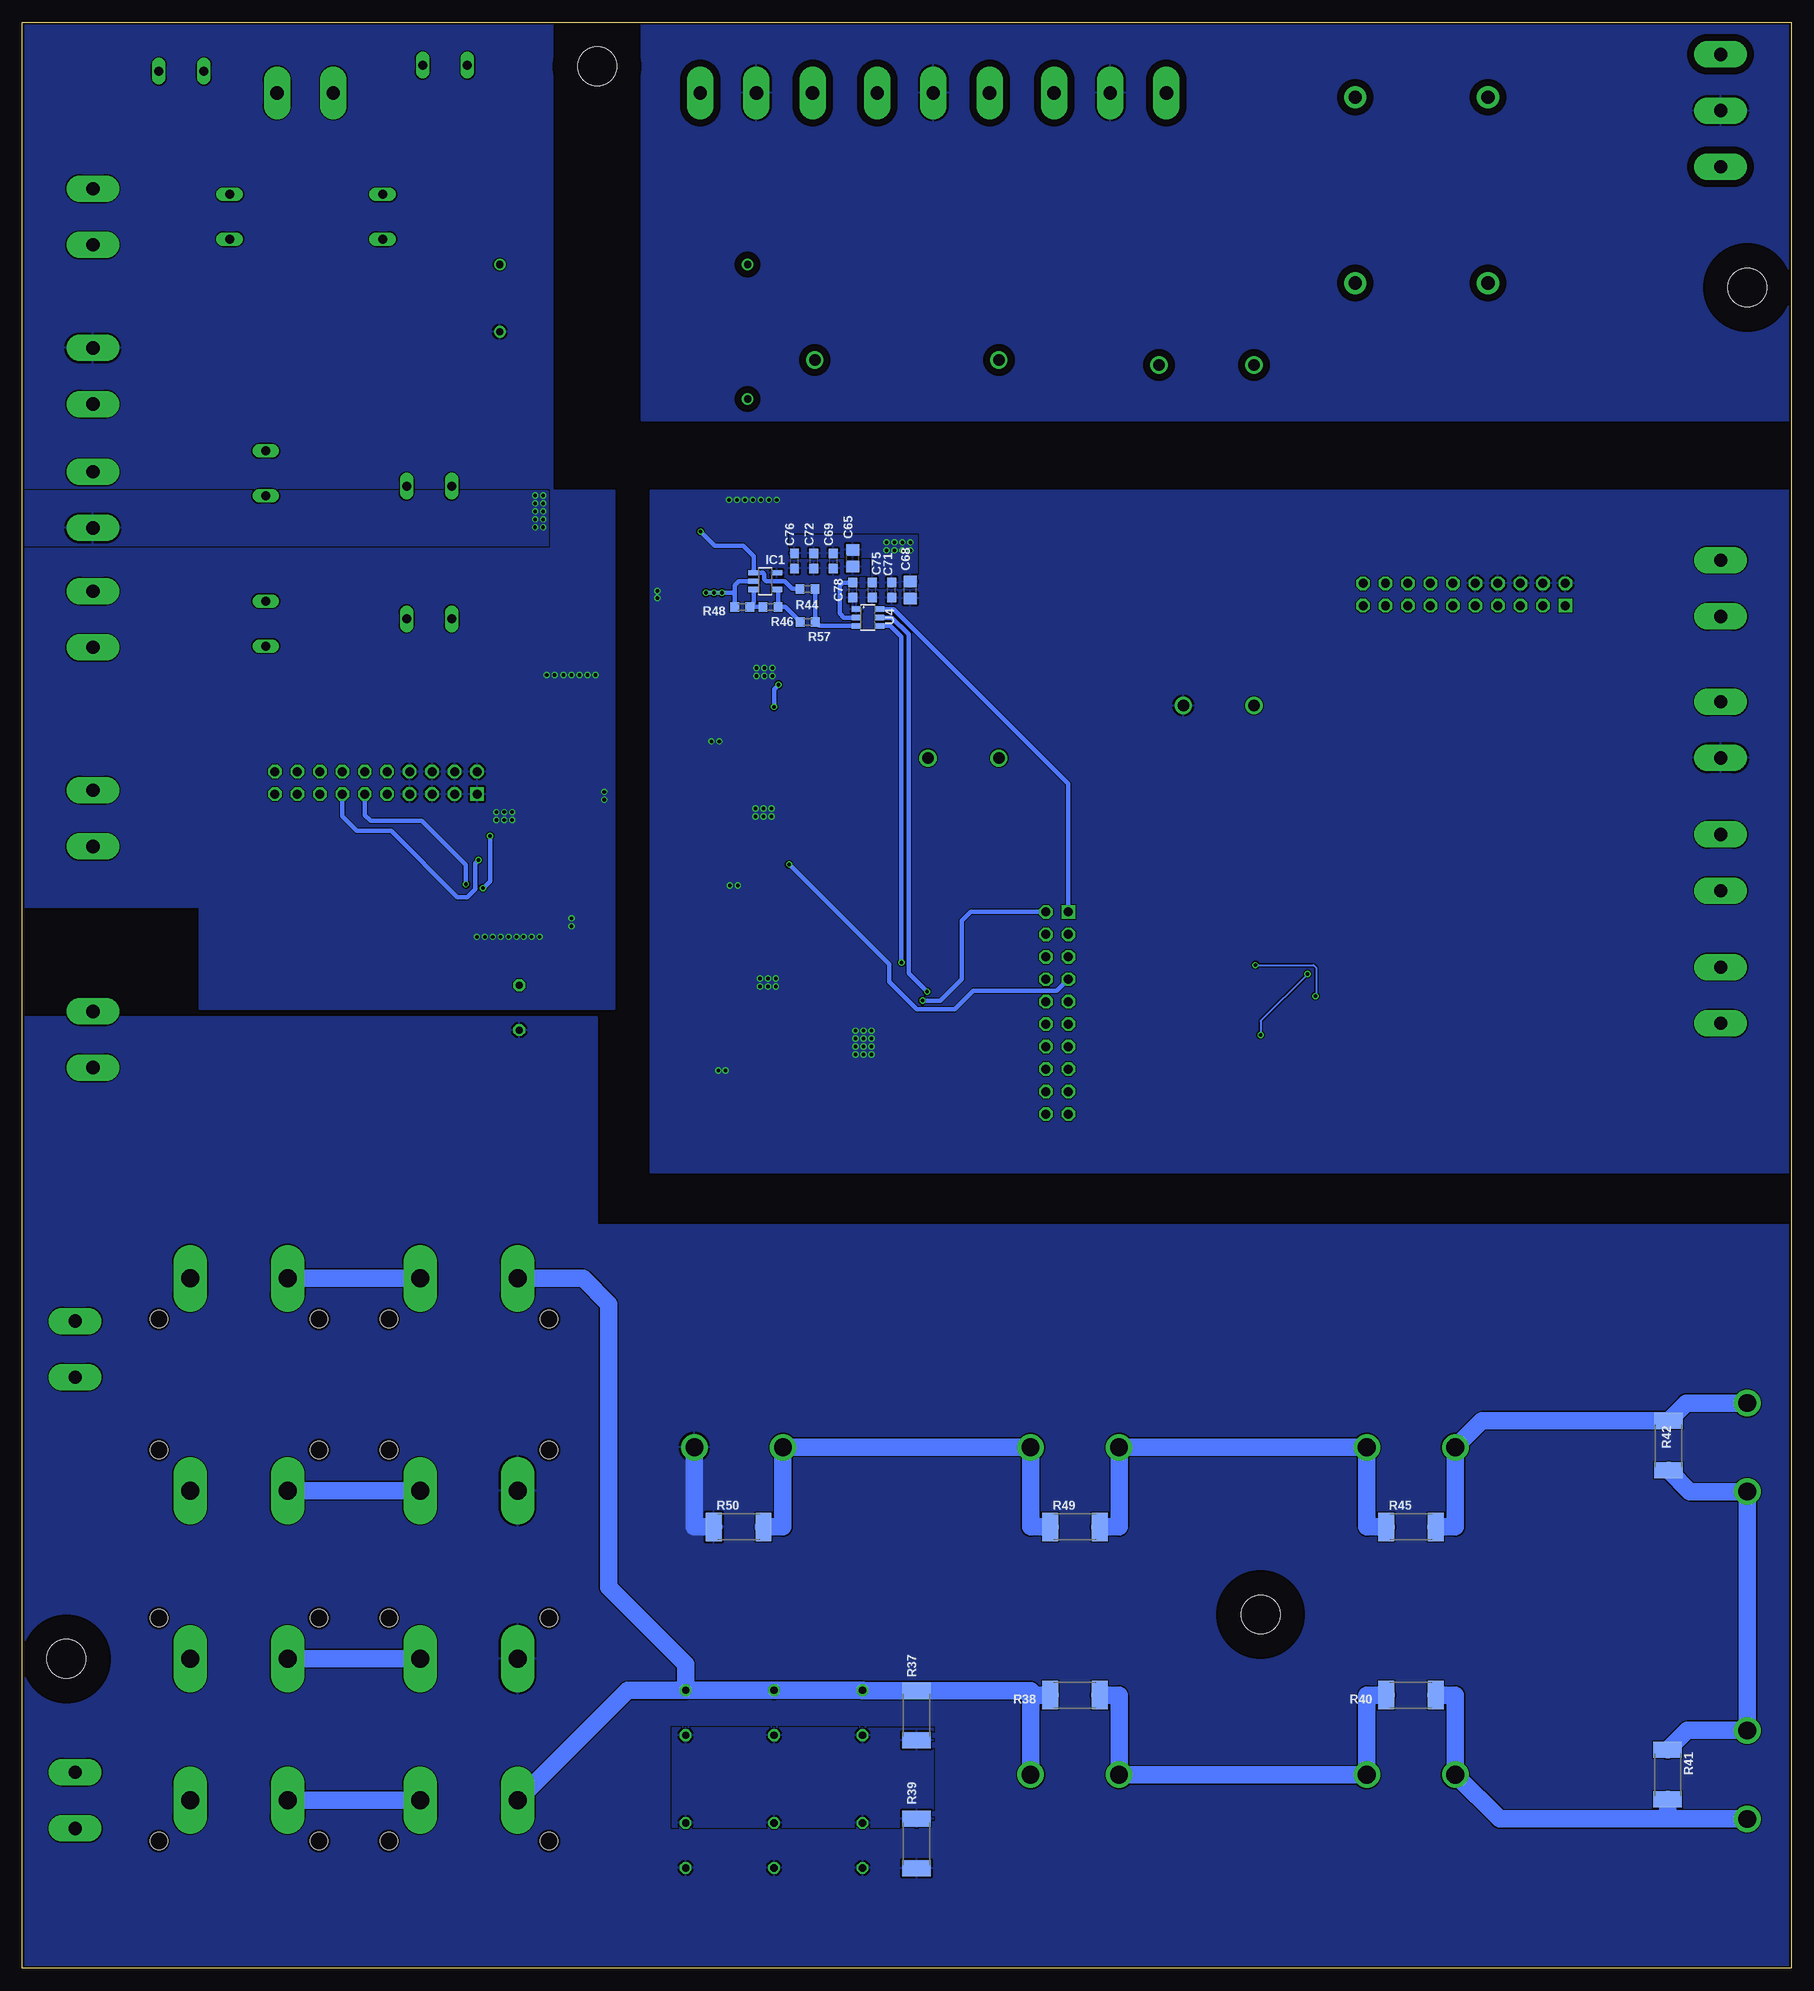
[diagram p5: board, bottom side, seen from below]

Size 200 x 220 mm. Coordinates in mm from the lower left corner, seen from the top.
Outline: 0,0 200,0 200,220 0,220 0,0
Copper layers (1*16): Top 0.035mm / dielectric 1.5mm / Bottom 0.035mm
Design rules "dirtyPCBdru": minimum track width 5mil, minimum drill 12mil, track to track 5mil, track to pad 5mil, pad to pad 5mil, via to via 5mil, smd to smd 0mil, copper to edge 10mil, drill to drill 10mil, minimum pad ring 10mil, minimum via ring 6mil, stop-mask expansion 2mil, vias tented up to drill 25mil, thermal gap 10mil
Holes 4.4 mm at 5,190 195,35 60,40 135,215
tRestrict: area 0,185 to 10,195; area 190,30 to 200,40; area 55,35 to 65,45; area 130,210 to 140,220
bRestrict: area 0,185 to 10,195; area 190,30 to 200,40; area 55,35 to 65,45; area 130,210 to 140,220
vRestrict: area 0,185 to 10,195; area 190,30 to 200,40; area 55,35 to 65,45; area 130,210 to 140,220

### Footprints (pad centres in the part's own frame; a part is rotated, then mirrored left to right if it is on the bottom)
C0805 = smd 1.3 x 1.5: 1 -0.95,0; 2 0.95,0
C0603 = smd 1.1 x 1: 1 -0.85,0; 2 0.85,0
C1210 = smd 1.6 x 2.7: 1 -1.4,0; 2 1.4,0
C1206 = smd 1.6 x 1.8: 1 -1.4,0; 2 1.4,0
C050-075X075 = drill 0.813 octagon: 1 -2.54,0; 2 2.54,0
STYLE_D(35MM) = drill 2: +VE 5,0; -VE -5,0
SMA/DO-214AC = smd 2.5 x 1.7: A 2,0; C -2,0
TO220ACS = drill 1.016 long: A 2.54,-2.54; C -2.54,-2.54
TO-247-2-WA-T247-101E = drill 2.032 pad 3.81 long: 1 0,5.5; 3 0,-5.5 | hole 2: 4.6,9.05; 4.6,-9.05
SOT23-5 = smd 0.6 x 1.2: 1 -0.95,-1.306; 2 0,-1.306; 3 0.95,-1.306; 4 0.95,1.306; 5 -0.95,1.306
WE-FCL_ET35 = drill 1.5 pad 2.5: 1 -10.5,7.5; 2 -10.5,-7.5; 3 10.5,-7.5; 4 10.5,7.5
WE-HCF_2920_ROUND = smd 8 x 8.5: 1 0,8.5; 2 0,-8.5
DIL-100-2X10 = drill 1.016 square: 1 -11.43,-1.27 | drill 1.016 octagon: 2 -11.43,1.27; 3 -8.89,-1.27; 4 -8.89,1.27; 5 -6.35,-1.27; 6 -6.35,1.27; 7 -3.81,-1.27; 8 -3.81,1.27; 9 -1.27,-1.27; 10 -1.27,1.27; 11 1.27,-1.27; 12 1.27,1.27; 13 3.81,-1.27; 14 3.81,1.27; 15 6.35,-1.27; 16 6.35,1.27; 17 8.89,-1.27; 18 8.89,1.27; 19 11.43,-1.27; 20 11.43,1.27
SMV1/SMF2 = smd 2.6 x 2.9: 1 -2.7,0; 2 2.7,0
R0603 = smd 1 x 1.1: 1 -0.85,0; 2 0.85,0
R2512 = smd 1.8 x 3.2: 1 -2.8,0; 2 2.8,0
TP16R = smd 1.6 x 1.6: TP 0,0
SOT23-6 = smd 0.6 x 1.1: 1 -0.95,-1.3; 2 0,-1.3; 3 0.95,-1.3; 4 0.95,1.3; 5 0,1.3; 6 -0.95,1.3
SO16 = smd 0.66 x 2.032: 1 -4.445,-3.073; 2 -3.175,-3.073; 3 -1.905,-3.073; 4 -0.635,-3.073; 5 0.635,-3.073; 6 1.905,-3.073; 7 3.175,-3.073; 8 4.445,-3.073; 9 4.445,3.073; 10 3.175,3.073; 11 1.905,3.073; 12 0.635,3.073; 13 -0.635,3.073; 14 -1.905,3.073; 15 -3.175,3.073; 16 -4.445,3.073
SOIC_16 = smd 2.2 x 0.6: 1 -4.6,4.445; 2 -4.6,3.175; 3 -4.6,1.905; 4 -4.6,0.635; 5 -4.6,-0.635; 6 -4.6,-1.905; 7 -4.6,-3.175; 8 -4.6,-4.445; 9 4.6,-4.445; 10 4.6,-3.175; 11 4.6,-1.905; 12 4.6,-0.635; 13 4.6,0.635; 14 4.6,1.905; 15 4.6,3.175; 16 4.6,4.445
IRM_1-2_TH = drill 0.8: +V -14,0; -V -14,-7.6; AC/L 14,7.6; AC/N 14,-7.6
SOT23-6' = smd 0.6 x 0.9: 1 -0.95,-1.15; 2 0,-1.15; 3 0.95,-1.15; 4 0.95,1.15; 5 0,1.15; 6 -0.95,1.15
IRM_5-10_TH = drill 1.3: +V 19.25,-1.25; -V 19.25,-9.25; AC/L -19.25,-9.25; AC/N -19.25,1.5
IRM_15-20_TH = drill 1.3: +V 22.2,-2.4; -V 22.2,-10.4; AC/L -22.8,10.4; AC/N -22.8,-10.4
AKL701_3_15 = drill 1.5 pad 3 long: 1 -6.35,0; 2 0,0; 3 6.35,0
AKL701_2_15 = drill 1.5 pad 3 long: 1 -3.175,0; 2 3.175,0

### Placement (x,y rotation side)
C1  118.8,131.7 90 top
C2  143.1,132 90 top
C3  141.6,119 90 top
C4  121,131.2 90 top
C5  136.5,131.5 90 top
C6  143.8,118.5 90 top
C7  123.2,131.2 90 top
C8  140.9,131.5 90 top
C9  146,118.5 90 top
C10  125.4,131.2 90 top
C11  138.7,131.5 90 top
C12  148.2,118.5 90 top
C13  118.4,147.8 90 top
C14  142.4,148.1 90 top
C15  120.6,147.3 90 top
C16  140.2,148.2 90 top
C17  122.8,147.3 90 top
C18  138,148.2 90 top
C19  125,147.3 90 top
C20  135.8,148.2 90 top
C21  16.6,212.8 270 top
C22  58.96,204.79 270 top
C23  23.7,209.1 270 top
C24  64.9,202.5 270 top
C25  16.6,206.1 270 top
C26  58.96,198.13 270 top
C27  163.6,190 270 top
C28  165.8,189.7 270 top
C29  168,189.7 270 top
C30  170.1,189.7 270 top
C31  138.4,156.8 90 top
C32  140.6,156.8 90 top
C33  142.8,156.8 90 top
C34  145,156.8 90 top
C35  152.2,179.8 270 top
C36  154.4,179.7 270 top
C37  156.6,179.7 270 top
C38  158.8,179.7 270 top
C39  60.8,111.3 90 top
C40  63.4,102.7 270 top
C41  61.3,103.2 270 top
C42  59.2,103.2 270 top
C43  57.1,103.2 270 top
C44  22.9,102.7 270 top
C45  20.7,102.2 270 top
C46  18.5,102.3 270 top
C47  16.3,102.3 270 top
C48  14.1,102.3 270 top
C49  67.4,129.4 180 top
C50  67.9,131.5 180 top
C51  67.9,133.6 180 top
C52  67.9,135.7 180 top
C53  99,122.8 0 top
C54  98.5,125 0 top
C55  98.5,127.2 0 top
C56  98.5,129.4 0 top
C57  105,28.9 270 top
C58  115,28.9 270 top
C59  125,28.9 270 top
C60  81,21.9 0 top
C61  105,13.9 270 top
C62  115,13.9 270 top
C63  125,13.9 270 top
C64  43,21.9 0 top
C65  106.1,159.4 90 bottom
C66  5,21.9 270 top
C67  114.9,163.7 270 top
C68  99.6,155.8 90 bottom
C69  108.3,159.1 90 bottom
C70  117.1,164 270 top
C71  101.7,155.8 90 bottom
C72  110.5,159.1 90 bottom
C73  119.4,164 270 top
C74  5,58.9 270 top
C75  103.9,155.8 90 bottom
C76  112.7,159.1 90 bottom
C77  121.7,164 270 top
C78  106.1,155.8 90 bottom
C79  43,58.9 180 top
C80  121.6,158.1 270 top
C81  81,58.9 180 top
C82  119,58.9 180 top
C83  110.1,100.1 0 top
C84  110,102.3 0 top
C85  118.4,112.5 90 top
C86  100.7,100.9 180 top
C87  143.8,108.6 90 top
C88  110,104.5 0 top
C89  120.6,112 90 top
C90  101.2,103.1 180 top
C91  110,106.7 0 top
C92  122.8,112 90 top
C93  101.2,105.3 180 top
C94  124.99,112.02 90 top
C95  101.2,107.5 180 top
C96  123.8,107.4 180 top
D1  158.3,119.6 270 top
D2  155,119.6 90 top
D3  156.7,198 90 top
D4  174,198 90 top
D5  152.2,212.6 180 top
D6  182,217 0 top
D7  175,169 270 top
D8  175,152 270 top
D9  154,165 180 top
D10  154,150 180 top
D11  149.5,78 270 top
D12  149.5,19 270 top
D13  175.5,78 270 top
D14  175.5,19 270 top
D15  175.5,54 90 top
D16  175.5,35 90 top
D17  149.5,35 90 top
D18  149.5,54 90 top
IC1  116,156.8 270 bottom
IC2  110.4,109.6 90 top
L1  41.8,201 90 top
L2  37.6,106.4 270 top
P1  83,108 270 top
P2  160,134 0 top
P3  37,155.3 0 top
R1  152.8,100.9 90 top
R2  159.9,103.6 180 top
R3  168.7,103.6 0 top
R4  175.4,106.3 270 top
R5  137.9,121 270 top
R6  175.4,114.8 90 top
R7  123.8,122.4 180 top
R8  168.3,117.5 0 top
R9  119.4,127.9 0 top
R10  141.9,128 0 top
R11  115.6,126.2 0 top
R12  138.4,126.7 0 top
R13  119,124.8 0 top
R14  141.8,125.3 0 top
R15  161.2,118.4 270 top
R16  115.6,123.6 0 top
R17  138.4,123.7 0 top
R18  134.2,135.1 270 top
R19  124.2,138.7 180 top
R20  121.3,143.9 0 top
R21  136.5,144.4 0 top
R22  117.8,142.6 0 top
R23  139.72,142.89 0 top
R24  121.3,141.3 0 top
R25  141.4,140.7 0 top
R26  117.6,140 0 top
R27  141.4,137.5 0 top
R28  114.9,140.1 90 top
R29  117.6,137.8 180 top
R30  138.7,137 90 top
R31  138.7,140.2 90 top
R32  60.8,108.2 90 top
R33  67.4,105.6 270 top
R34  52.2,110.8 270 top
R35  70.1,106.5 180 top
R36  52.2,114 270 top
R37  98.9,28.6 90 bottom
R38  81,30.9 180 bottom
R39  98.9,14.1 90 bottom
R40  43,30.9 180 bottom
R41  14,21.9 270 bottom
R42  13.9,59.1 270 bottom
R43  126.3,155.5 0 top
R44  111.22,155.93 180 bottom
R45  43,49.9 0 bottom
R46  115.4,153.9 180 bottom
R47  126.3,153.2 180 top
R48  118.6,153.9 0 bottom
R49  81,49.9 0 bottom
R50  119,49.9 0 bottom
R51  105.1,111.3 0 top
R52  123.8,101.5 180 top
R53  105.1,109.1 0 top
R54  110.8,113.1 270 top
R55  113,113.1 270 top
R56  127.3,101.5 180 top
R57  111.2,152.2 180 bottom
TP1  127.7,114.7 0 top
TP2  123.1,167.7 0 top
U1  150.8,118.9 0 top
U2  130.7,125.6 270 top
U3  130.3,142 270 top
U4  104.4,152.7 270 bottom
U5  130,162 180 top
U6  100.8,110.4 90 top
U7  132.2,108 180 top
VR1  132,185 180 top
VR2  DNF-TPS56339DDCR  [SOT23-6']  57.7,106.4 270 top
VR3  70,162 270 top
VR4  100,159 270 top
X1  8,210 270 top
X2  192,198 90 top
X3  77,212 180 top
X4  168,212 180 top
X5  117,212 180 top
X6  97,212 180 top
X7  192,166 90 top
X8  192,152.5 90 top
X9  192,180 90 top
X10  8,110 270 top
X11  8,140 270 top
X12  8,125 270 top
X13  8,156 270 top
X14  192,105 90 top
X15  194,70 90 top
X16  194,19 90 top
X17  192,130 90 top

### Tracks (layer width: path | path; a pad name or v marks a point on that pad's centre or on a via)
!V_OUT_FWD_SS
  Top 0.5: R21.2 146,144.4 151.1,139.3 158.8,139.3 160,138.1 160,134 P2.9
!V_OUT_RVS_SS
  Top 0.5: P2.10 158.73,137.97 158.1,138.6 150.5,138.6 146.21,142.89 R23.2
!VALVE_GRID_CUR_SS
  Bottom 0.5: U4.6 101.45,153.65 81.73,133.93 P1.1
!VALVE_OUT_FWD_SS
  Top 0.5: R20.1 112.3,143.9 105.8,137.4 105.8,123.1 98.3,115.6 83.02,115.6 P1.3
!VALVE_OUT_RVS_SS  (via drill 0.4)
  Top 0.5: v114.5,145.1 111.5,145.1 104.5,138.1 104.5,123.5 97.89,116.89 P1.4 | v115,142.6 R22.1
  Bottom 0.5: v114.5,145.1 115,144.6 v115,142.6
!VALVE_PLATE_CUR_SS  (via drill 0.4)
  Top 0.5: U6.6 99.45,109.4 v98.2,109.4
  Bottom 0.5: v98.2,109.4 96.2,109.4 93.79,111.81 93.79,118.41 92.77,119.43 P1.2
!VALVE_VOLT_SS
  Top 0.5: R9.1 118.45,128 112.9,128 99.25,114.35 P1.6
+4V
  pour Top (no thermals): 33.3,110.3 4.9,110.3 4.9,102.5 33.3,102.5
+5V  (via drill 0.4)
  Top 0.5: R7.2 v120,122.4 v119.1,122.4 | R19.2 v122.1,138.7 v121.2,138.7 | R52.2 v121.3,101.5 v120.5,101.5 | R43.2 128,155.5 v128.2,155.7 v128.2,154.9
  Top 1: VR3.+V C52.1 C51.1 C50.1 68.75,129.8 C49.1
  other vias: 115.3,131.1 116.2,131.1 117.1,131.1 115.3,130.2 116.2,130.2 117.1,130.2 115.2,147 116.1,147 117,147 115.2,146.1 116.1,146.1 117,146.1 115.7,111 116.6,111 114.8,111 114.8,111.9 115.7,111.9 116.6,111.9 104.9,105.1 105.8,105.1 104,105.1 104,106 104.9,106 105.8,106 104.9,103.3 105.8,103.3 104,103.3 104,104.2 104.9,104.2 105.8,104.2 120.1,166 119.2,166 118.3,166 117.4,166 116.5,166 115.6,166 114.7,166
  pour Bottom (rank 5): -1.6,167 129,167 129,90 -1.6,90
  pour Top (no thermals): 114.8,131.6 119.5,131.6 120.2,130.9 128.7,130.9 128.7,129.6 114.8,129.6
  pour Top: 114.7,147.3 119.9,147.3 119.9,147 128.5,147 128.5,145.8 114.7,145.8
  pour Top (no thermals): 114.3,112.3 119.8,112.3 119.8,111.7 128.9,111.7 128.9,110.6 114.3,110.6
  pour Top: 101.5,109.7 101.5,101.7 101.1,101.7 101.1,99.3 109.7,99.3 109.7,108.9 108.2,108.9 108.2,107.6 103.2,107.6 103.2,109.7
  pour Top: 114.1,164 123,164 123,164.6 126.6,164.6 126.6,165.5 123,165.5 123,166.5 114.1,166.5
+12V
  Top 1: VR4.+V 97.65,134.75 C56.1 C55.1 C54.1 97.65,123.2 C53.1 81.1,122.8 78.3,120 78.3,107.2 75.85,104.75 R33.2
  Top 2: X12.2 5.03,121.83 2.75,124.1 2.75,144.85 5.2,147.3 7.7,147.3 | 7.7,147.3 91.3,147.3 97.6,141 VR4.+V | 7.7,147.3 7.7,152.53 X13.2
  pour Top (no thermals): 56.1,105.6 56.1,103.6 62.4,103.6 62.4,102.9 72.5,102.9 72.5,105.3 62.2,105.3 62.2,104.7 57.3,104.7 57.3,105.6
  pour Top (no thermals): 36.8,155 4.9,155 4.9,146.3 36.8,146.3
AC/L
  Top 1: C22.1 58.96,211.46 59,211.5
  Top 2: 65.6,211.5 70.15,211.5 X3.3 70.65,215.75 72.3,217.4 90.7,217.4 | C24.1 64.9,210.8 65.6,211.5 | 90.7,217.4 108.7,217.4 110.65,215.45 X5.3 | VR1.AC/L 116.5,175.9 110,175.9 | 110,175.9 64.1,175.9 VR3.AC/L 47.25,181.25 42.2,186.3 42.2,204.4 L1.3 59,211.5 65.6,211.5 | VR4.AC/L 110.4,176.3 110,175.9 | X6.3 90.65,217.35 90.7,217.4
AC/N
  Top 1: C26.2 58.96,192.86 58.7,192.6
  Top 2: 103.3,192.6 VR1.AC/N 123.35,197.95 X5.1 | 103.3,192.6 89.6,192.6 | 89.6,192.6 83.2,192.6 | 83.2,192.6 71.4,192.6 | 71.4,192.6 64.8,192.6 | VR3.AC/N 71.5,192.5 71.4,192.6 | VR4.AC/N 89.6,192.6 | C24.2 64.9,192.7 64.8,192.6 | X3.1 83.35,192.75 83.2,192.6 | X6.1 103.35,192.65 103.3,192.6 | L1.2 51.4,192.6 58.7,192.6 64.8,192.6
EARTH
  Top 1: C22.2 C26.1
  pour Top: -1,221 130,221 130,175 -1,175
  pour Bottom: -1,221 130,221 130,175 -1,175
GND  (via drill 0.4)
  Bottom 0.5: U4.2 107.1,152.7 107.6,153.2 107.6,156.3 107.25,156.65 C78.2 | IC1.2 119,156.8 119.45,156.35 119.45,155.5 | 119.45,155.5 R48.1 | 119.45,155.5 v120.9,155.5 v121.8,155.5 v122.7,155.5
  other vias: 99.6,161.2 99.6,160.3 100.5,160.3 101.4,160.3 102.3,160.3 102.3,161.2 101.4,161.2 100.5,161.2
  pour Top (rank 5): -1,167 129,167 129,90 -1,90
  pour Bottom: 98.9,156.1 106.6,156.1 106.6,157.2 103.9,157.2 103.9,159.5 113.2,159.5 113.2,162 98.9,162
GRID_CURR_AMP
  Bottom 0.5: R44.1 110.35,155.91 R57.1 109.9,151.75 U4.3
GRID_CURR_FAULT
  Top 0.5: TP2.TP 125,167.7 125.4,167.3 U5.9
GRID_CURR_OUT  (via drill 0.4)
  Top 0.5: v123.3,162.4 123.53,162.63 U5.12
  Bottom 0.5: v123.3,162.4 121.7,160.8 118.5,160.8 117.31,159.61 IC1.1 116.25,157.75 116.1,157.6 116.1,157 115.9,156.8 113.8,156.8 112.93,155.93 R44.2
N$1
  pour Top: 154,217 167.5,217 167.5,200 154,200
N$2
  pour Top: 168.5,217 182,217 182,200 168.5,200
N$3
  Bottom 0.5: R57.2 113.75,153.9 R46.1 114.55,155.71 IC1.4
N$6
  Top 0.25: VR2.5 67.35,106.4 R33.1 69.2,106.45 R35.2
N$8
  Top 0.5: R51.2 108.34,111.3 IC2.4 109.09,112.99 110.05,113.95 R54.1
N$9
  pour Top: 155,170 185,170 185,160 196,160 196,154 178,154 178,158 155,158
N$10
  pour Top (no thermals): 155,153.1 155,137 196,137 196,153.1
N$31
  Top 1: X1.1 14.45,216.35 C21.1 20,214.2 C23.1 33.3,210.5 L1.4
N$35
  Top 1: X1.3 15.55,203.65 C25.2 20.7,204.7 | 20.7,204.7 C23.2 | 20.7,204.7 29.7,204.7 34.3,200.1 L1.1
N$36
  Bottom 2: R49.1 86,49.9 C81.-VE C82.+VE 114,49.9 R50.2
N$40
  Top 0.5: R28.2 115.25,141.3 R24.1
N$41
  Top 0.5: U2.5 127.46,124.8 R13.2
N$42
  Top 0.5: R16.2 127.53,123.6 U2.6
N$44
  Top 0.5: R11.2 127.59,126.2 U2.4
N$46
  Top 0.5: U2.3 127.23,127.9 R9.2
N$47
  Top 0.5: R7.1 124.67,122.42 U2.7
N$50
  Top 0.5: U2.10 137.32,122.42 R5.1
N$51
  Top 0.5: U2.12 136.37,124.97 136.7,125.3 R14.1
N$54
  Top 0.5: R17.1 U2.11
N$55
  Top 0.5: R27.1 140.2,137.85 R30.2 137.85,137.85 135.6,140.09 U3.11
N$56
  Top 2: D11.1 D13.3
  Bottom 2: D11.1 D13.3
N$57
  Top 0.5: U2.13 137.09,126.23 R12.1
N$58
  Top 0.5: U2.14 136.1,127.5 136.6,128 R10.1
N$59
  Top 2: D18.3 D15.1
  Bottom 2: D18.3 D15.1
N$60  (via drill 0.4)
  Top 0.5: v147.1,128 R10.2 | U1.6 149.85,121.05 148.8,122.1 v147.9,122.1
  Bottom 0.5: v147.1,128 147.1,122.9 v147.9,122.1
N$61
  Top 0.5: U3.13 138.62,142.63 R23.1
N$62
  Top 0.5: U3.14 135.16,143.91 R21.1
N$63
  Top 0.5: U1.3 D2.C D1.A 161.15,117.6 R15.2 | 165.55,117.55 R8.1
  Top 1: R15.2 165.55,117.55
N$65
  Top 2: D12.1 D14.3
  Bottom 2: D12.1 D14.3
N$66
  Top 2: D17.3 D16.1
  Bottom 2: D17.3 D16.1
N$68
  Top 1: R6.1 R4.1
N$69
  Bottom 2: R45.1 48,49.9 C79.-VE C81.+VE 76,49.9 R49.2
N$70
  Top 1: R8.2 R6.2
N$71
  Bottom 2: R42.2 11.5,53.9 C74.+VE C66.-VE 11.8,26.9 R41.1
N$72
  Bottom 2: R40.1 38,30.9 C64.-VE 33,16.9 14.7,16.9 | 14.7,16.9 C66.+VE | 14.7,16.9 14,17.6 R41.2
N$73
  Bottom 2: R38.1 76,30.9 C60.-VE C64.+VE 48,30.9 R40.2
N$74
  Bottom 2: R45.2 38,49.9 C79.+VE 35,61.9 R42.1 11.9,63.9 C74.-VE
N$75
  Top 1: R4.2 R3.2
N$76
  Top 0.5: R52.1 R56.2 126.45,103.15 126.86,103.56 U7.16
N$77
  Top 1: R2.2 R1.2
N$78
  Top 1: R3.1 R2.1
N$79
  Top 0.5: C96.1 127.61,107.4 U7.13
N$92
  Top 0.5: R24.2 127.16,141.3 U3.5
N$93
  Top 0.5: U3.6 118.55,140.09 R26.2
N$94
  Top 0.5: U3.4 118.69,142.63 R22.2
N$95
  Top 0.5: R20.2 U3.3
N$96
  Top 0.5: R19.1 125.05,138.82 U3.7
N$97
  Top 0.5: R18.1 135.05,135.95 135.5,136.4 135.5,138.4 135.07,138.82 U3.10
N$98
  Top 0.5: U3.12 138.38,141.37 R31.2 140.2,141.05 R25.1
N$99
  pour Bottom: 97,27.9 126.5,27.9 126.5,16 97,16
N$104
  Top 0.25: R32.2 C39.1
N$105  (via drill 0.4)
  Top 0.25: C39.2 60.8,113.2 v60.6,113.4
  Bottom 0.25: v53.8,109.9 53.7,110 53.7,113.1 54,113.4 v60.6,113.4
  pour Top (no thermals): 41.8,110.4 41.8,101.7 55.6,101.7 55.6,105.7 55.9,106 57.1,106 57.1,106.8 56,106.8 55.8,107 55.8,108.6 54.5,108.6 54.5,110.4
N$106
  Top 0.5: R29.2 R26.1
N$148  (via drill 0.4)
  Top 0.25: R34.1 R36.2 53.95,113.15 v54.7,112.4 | v60,105.5 59.95,105.45 VR2.4
  Bottom 0.25: v54.7,112.4 60,107.1 v60,105.5
N$149
  Top 0.5: R47.2 R43.1 125.45,157.5 U5.16
N$154
  Top 0.5: IC2.3 112.55,110.55 113,111 R55.2 R54.2
N$155
  Top 0.5: C80.1 124.02,161.37 U5.13
N$156
  Bottom 0.5: R46.2 R48.2 117.31,154.34 IC1.3
N$300
  Top 0.25: VR2.6 R32.1
PLATE_CURR_AMP
  Top 0.5: R53.1 R51.1 102.15,111.3 U6.3
PLATE_CURR_FAULT
  Top 0.5: TP1.TP 127.7,112.44 U7.9
PLATE_CURR_OUT
  Top 0.5: U7.12 127.64,108.65 IC2.1 110.95,108.65 110,109.6 106.45,109.6 R53.2
V_MISO  (via drill 0.4)
  Top 0.5: R17.2 148.7,123.7 v149.85,122.55 150.8,121.6 U1.5
  Bottom 0.5: P2.11 161.27,130.37 160.6,129.7 154.8,129.7 149.85,124.75 v149.85,122.55
V_MOSI  (via drill 0.4)
  Top 0.5: R14.2 v148.4,125.3
  Bottom 0.5: v148.4,125.3 148.8,124.9 148.8,122 149.7,121.1 150.8,121.1 158.3,128.6 162.2,128.6 163.81,130.21 P2.13
V_SCLK
  Top 0.5: R12.2 148.7,126.7 | U1.4 151.75,123.65 148.7,126.7 | 148.7,126.7 148.7,128.4 150.3,130 161.3,130 162.5,131.2 162.5,134.04 P2.12
VALVE_2.5KV
  Top 2: 152.5,97.9 R1.1 152.8,95.8 152,95 | D11.3 144,87 152,95 | 152,95 188.3,95 192,98.7 X14.1 X14.2
  Bottom 2: C60.+VE 86,30.9 | 86,30.9 R38.2 | 86,30.9 86,31.4 R37.2 105,31.4 C57.1 C58.1 C59.1 | D12.3 131.56,31.44 C59.1 | C59.1 125,34.4 133.7,43.1 133.7,75.1 136.6,78 D11.3
VALVE_5V  (via drill 0.4)
  Top 0.5: U1.1 149.85,118.75 150.1,119 153.2,119 153.8,119.6 158.1,119.6 158.3,119.8 D1.C | R5.2 v137.9,118.7 v137.9,117.8 | R18.2 v134.2,133 v134.2,132.1
  other vias: 144.6,130.7 144.6,129.8 146.4,130.7 146.4,129.8 145.5,130.7 145.5,129.8 141.5,116.6 144.1,116.6 143.3,116.6 145.9,116.6 142.4,116.6 145,116.6 146.8,116.6 148.6,116.6 147.7,116.6 135.2,146.2 136.1,146.2 137,146.2 137.9,146.2 138.8,146.2 139.8,146.2 140.7,146.2
  pour Top: 145,187 145,180 201,180 201,187
  pour Bottom (rank 5): 140,221.6 201.6,221.6 201.6,120 180,120 180,108.5 133,108.5 133,167 140,167
  pour Top: 132.7,129.4 132.7,131.1 146.7,131.1 146.7,129.4
  pour Top: 140.9,118.6 142.8,118.6 142.8,118.2 150.1,118.2 150.1,116 140.9,116
  pour Top: 132.4,145.8 143.1,145.8 143.1,147.7 132.4,147.7
VALVE_6V3
  pour Top: 156,190 186,190 186,199.1 195.2,199.1 195.2,205 183,205 183,199 156,199
VALVE_-30V  (via drill 0.4)
  other vias: 141.1,162.9 142,162.9 141.1,166.5 142,166.5 141.1,165.6 142,165.6 141.1,164.7 142,164.7 141.1,163.8 142,163.8
  pour Top (no thermals): 133.5,162.5 142.5,162.5 142.5,167 133.5,167
  pour Bottom: 140.6,167 140.6,160.8 201.6,160.8 201.6,167
VALVE_-30V_GEN
  pour Top: 133.5,161.5 144,161.5 144,169.8 152.5,169.8 152.5,140 151.3,140 146.2,145.1 146.2,157.2 133.5,157.2
VALVE_GND
  pour Top (rank 5): 140,221 201,221 201,120 180,120 180,108.5 133,108.5 133,167 140,167
VALVE_LOW
  Bottom 2: R50.1 124,49.9 C82.-VE
  pour Top (rank 5): -1,84 135,84 135,107.5 201,107.5 201,-1 -1,-1
  pour Bottom (rank 5): -1.6,84 135,84 135,107.5 201.6,107.5 201.6,-1.6 -1.6,-1.6
VALVE_MISO  (via drill 0.4)
  Top 0.5: R16.1 112.6,123.6 100.8,111.8 100.8,111.1 100.1,110.4 U6.5 v97.7,110.4 97.1,109.8 97.1,107 95.6,105.5 79.9,105.5 79.8,105.6 79.8,113.6 80.55,114.35 P1.5
  Bottom 0.5: U4.5 101.7,152.7 99.8,150.8 99.8,112.5 v97.7,110.4
VALVE_MOSI  (via drill 0.4)
  Top 0.5: R13.1 v113.3,124.8
  Bottom 0.5: v113.3,124.8 102,113.5 102,111.5 98.9,108.4 94.6,108.4 92.5,110.5 83.04,110.5 P1.7
VALVE_PWR_+VE
  pour Top (no thermals): 179,82 201,82 201,50 179,50
VALVE_PWR_-VE
  pour Top: 179,40 201,40 201,8 179,8
VALVE_SCLK  (via drill 0.4)
  Top 0.5: R11.1 113.1,126.2 v100.6,113.7 99.5,112.6 U6.4 93.45,111.35 92.99,111.81 P1.8
  Bottom 0.5: U4.4 101.85,151.75 100.6,150.5 v100.6,113.7

### Text on the board
Top: RF-PWR-001
tNames: 6V3 Out / Valve / Board | From 6V3 Transformer | To HV / Transformer | To 6V3 / Transformer | To -30V / Transformer | Spare 5V / VGND Out | RF-PWR-001 | 12V GND For Output Board | 5V Rasp Pi | GND | -30V For / Valve Board | 12V Arduino | GND | 5V GND For Input Board | From / 30V Transformer | Output Board SPI / and power | 12V GND For Input Board | HV GND Out | 2.5KV Out | HV | 4V GND SWR | Arduino SPI Input | HV | HV | HV | HV | HV | 1.78KV Phase 1 | HV | 1.78KV Phase 2 | HV | HV | HV | HV